# EAGLE schematic LinkIt ONE_v1.0 (EAGLE 6.4)
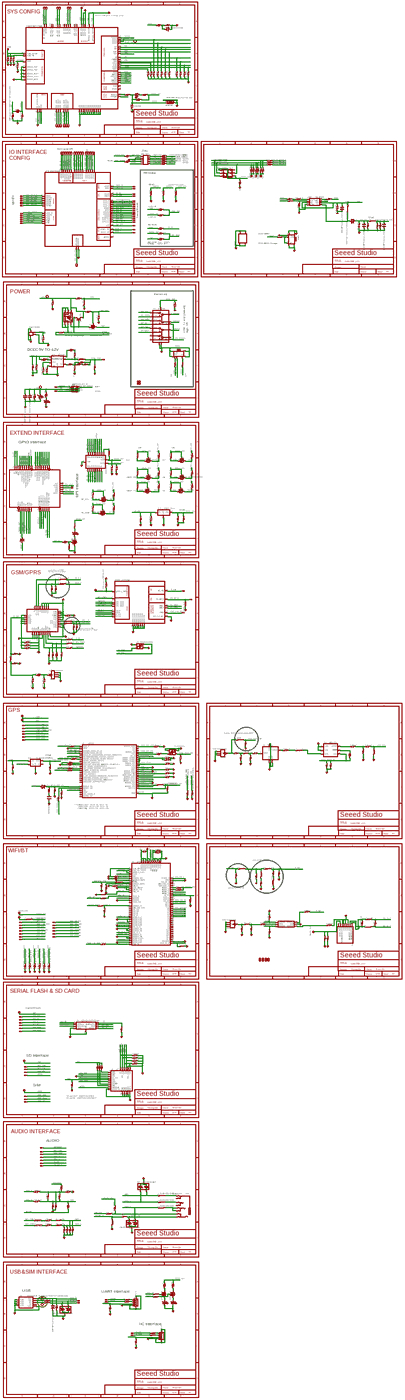
[diagram p0: schematic, sheet 1, overview]
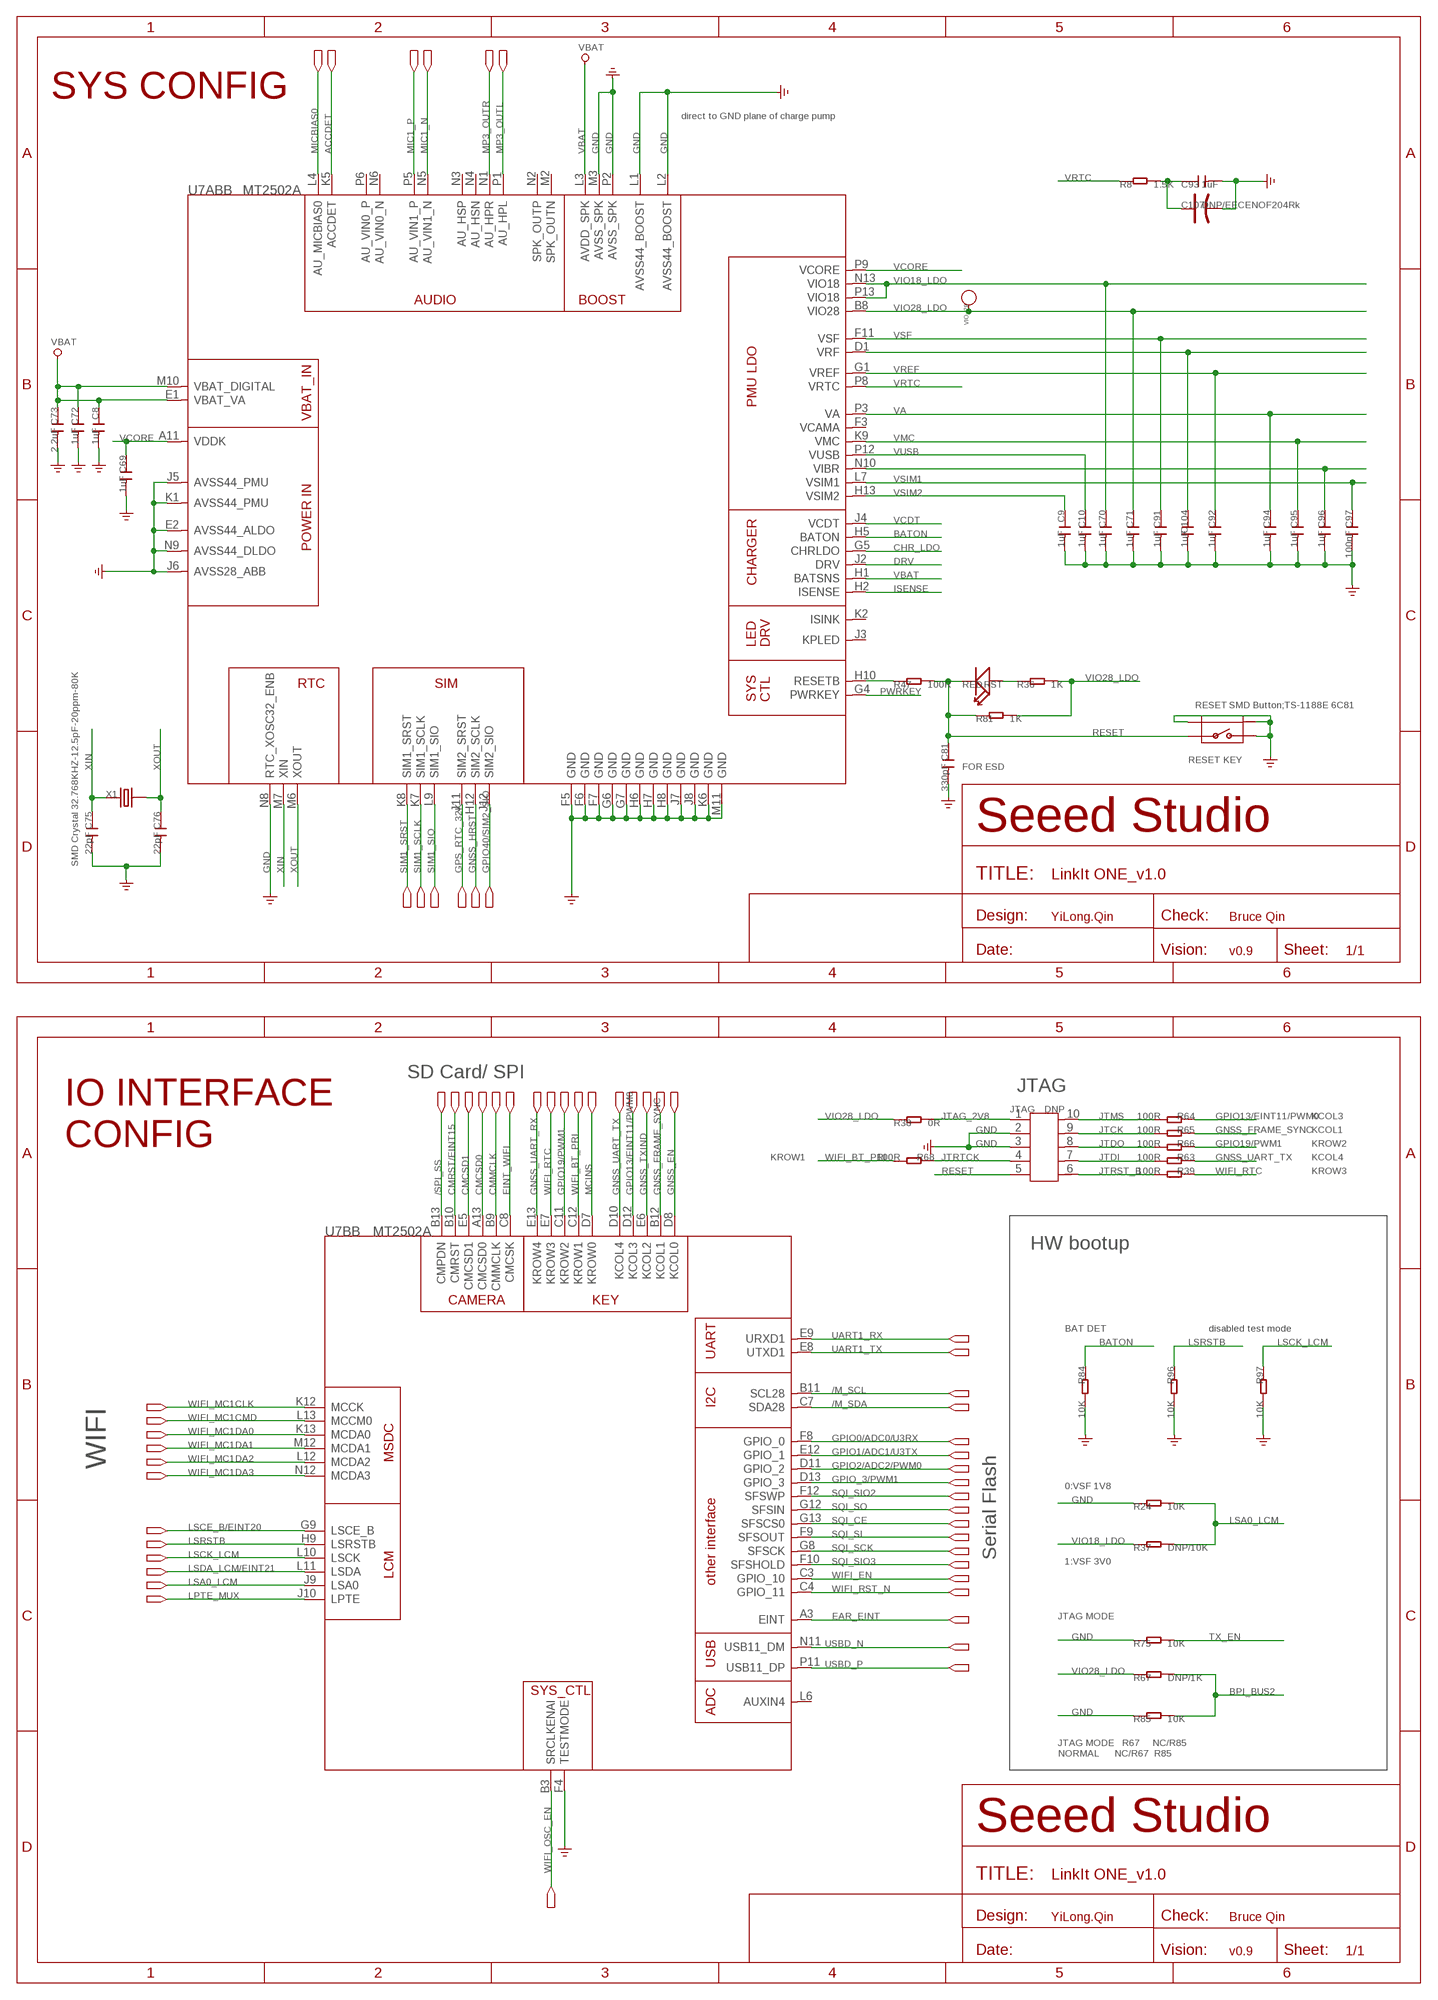
[diagram p1: schematic, sheet 1, part 1 of 8]
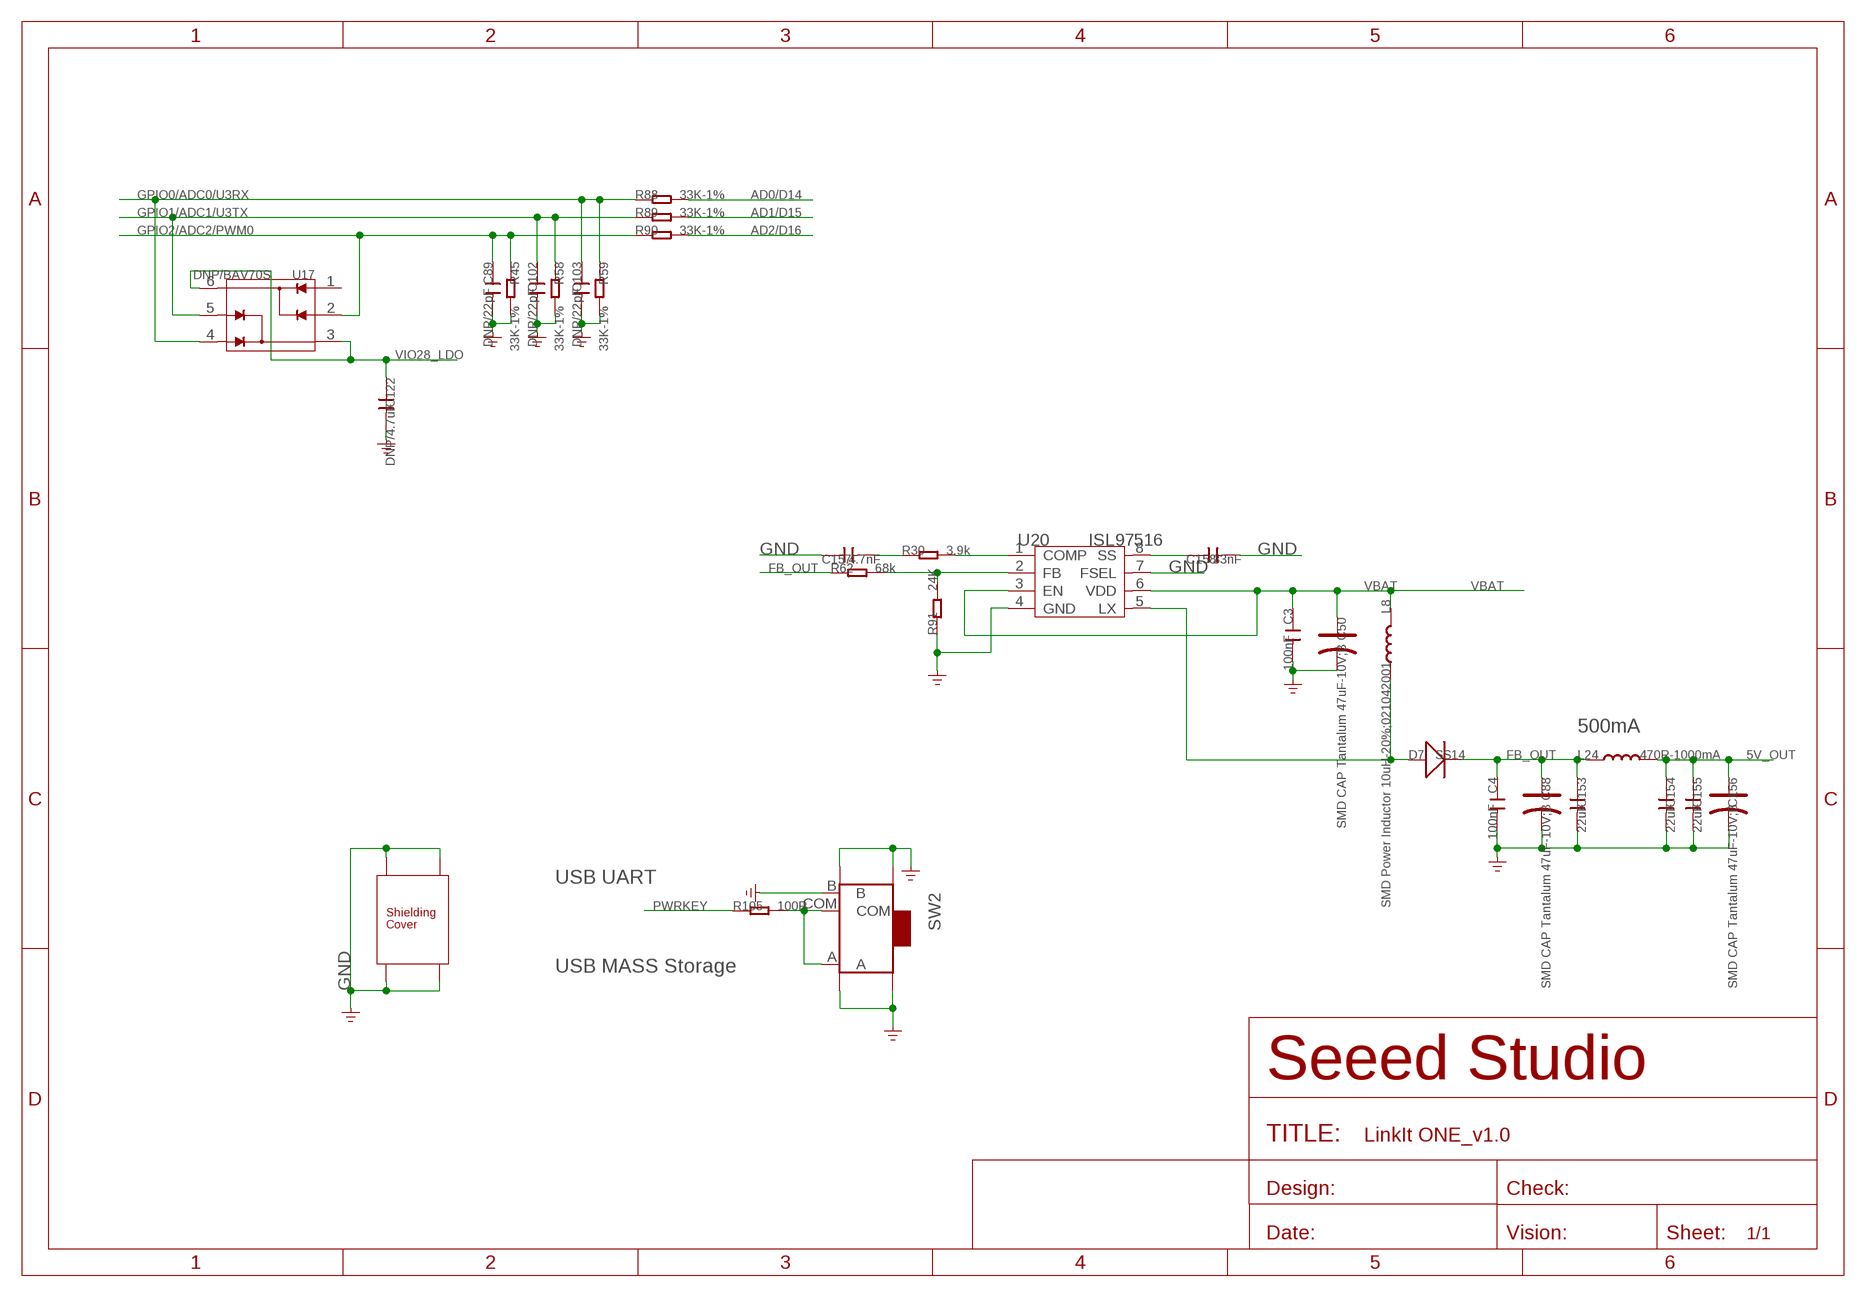
[diagram p2: schematic, sheet 1, part 2 of 8]
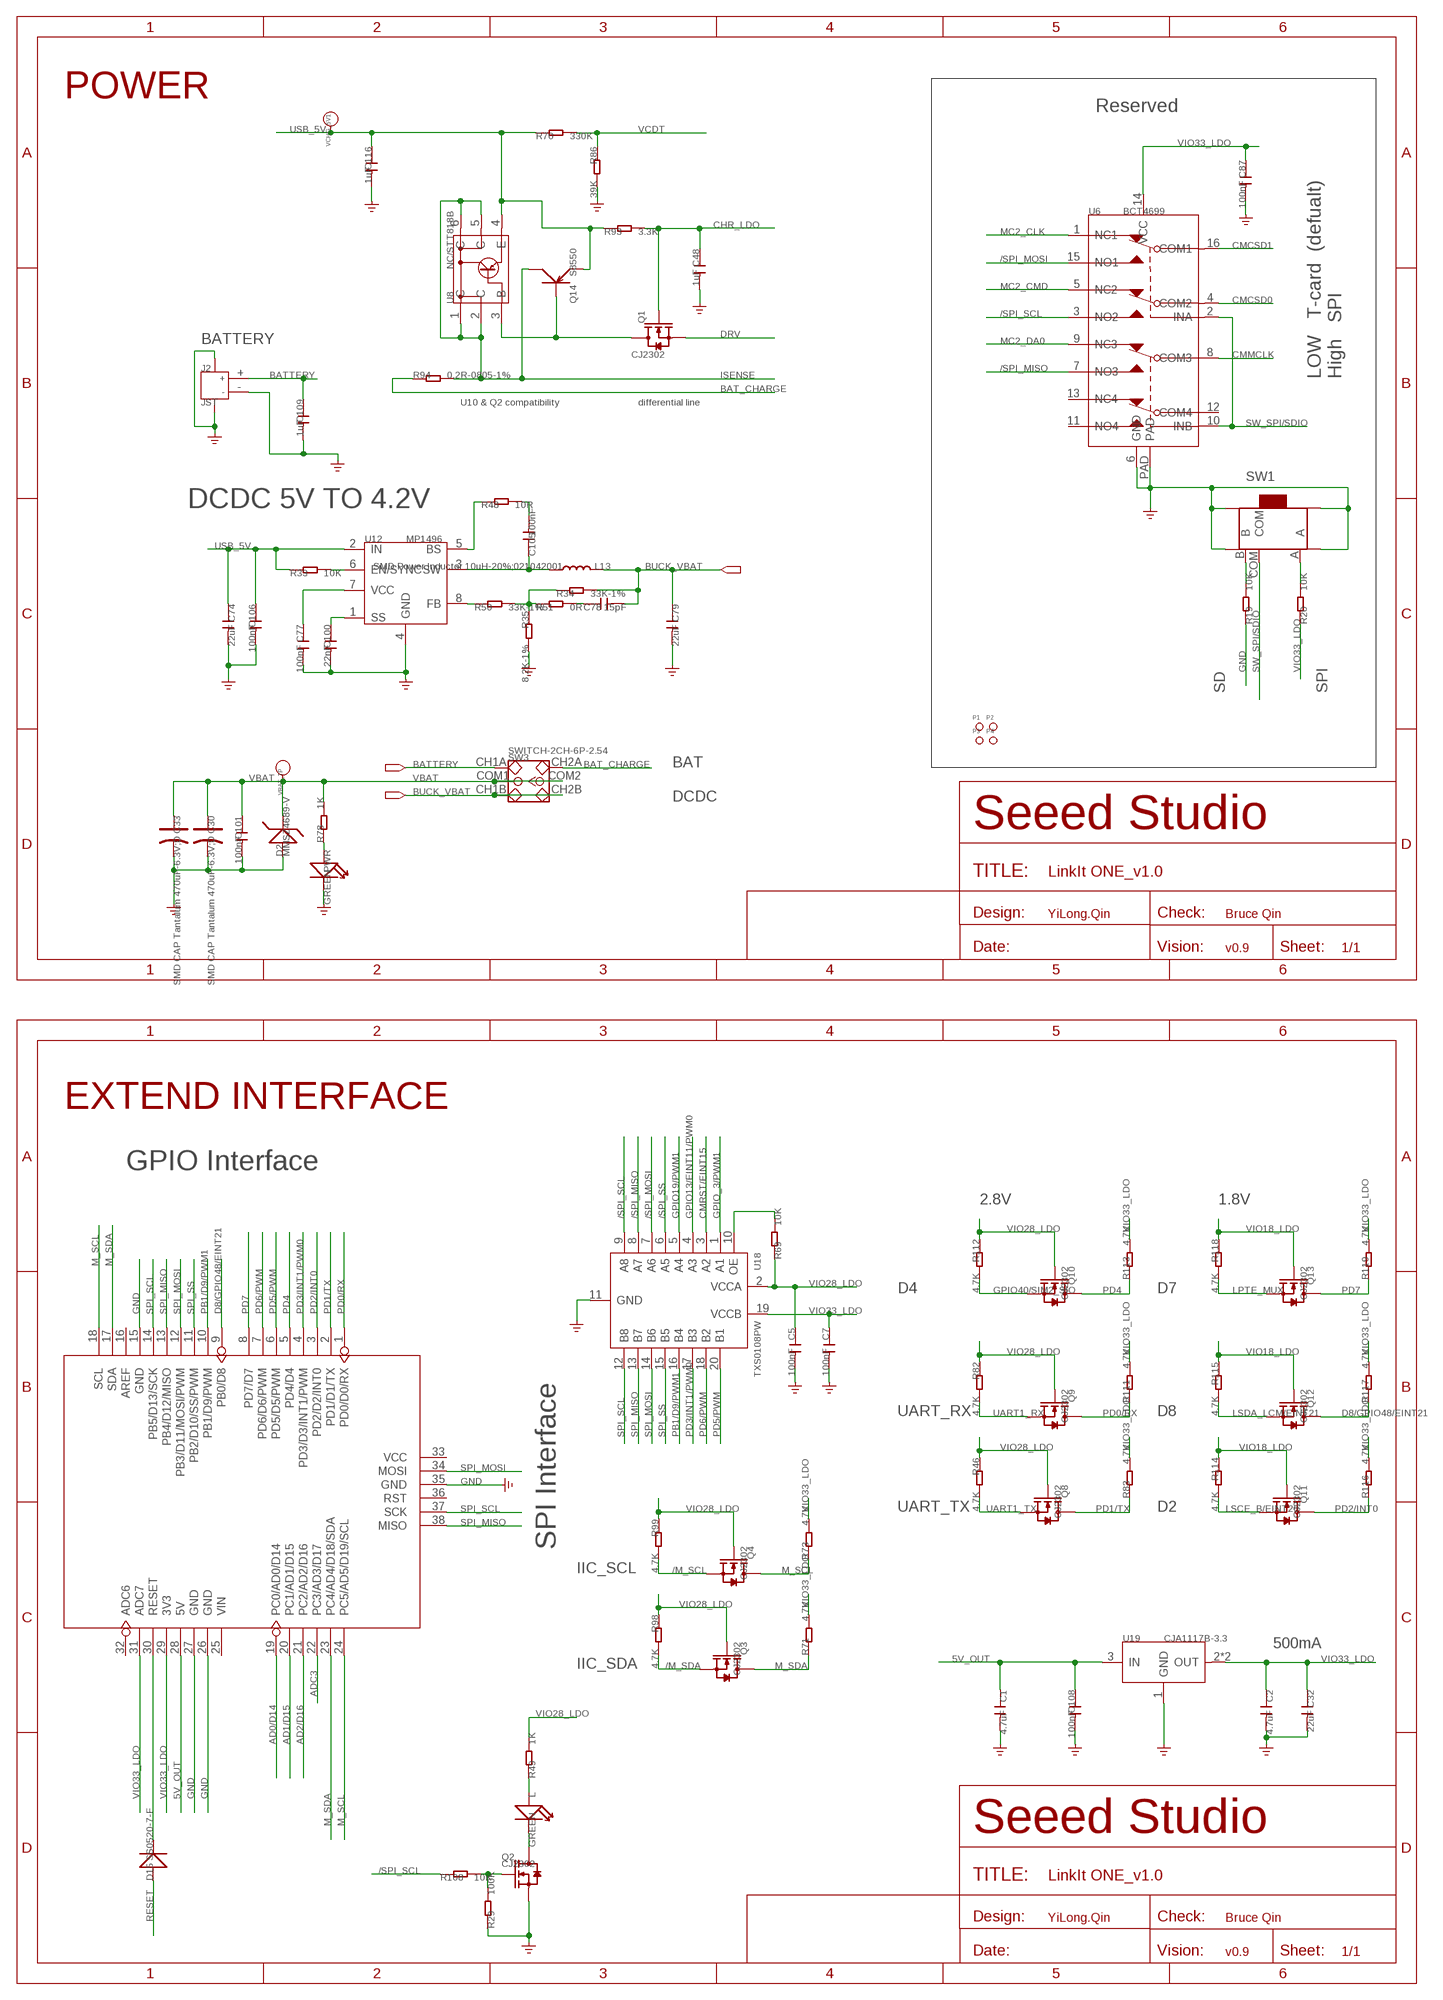
[diagram p3: schematic, sheet 1, part 3 of 8]
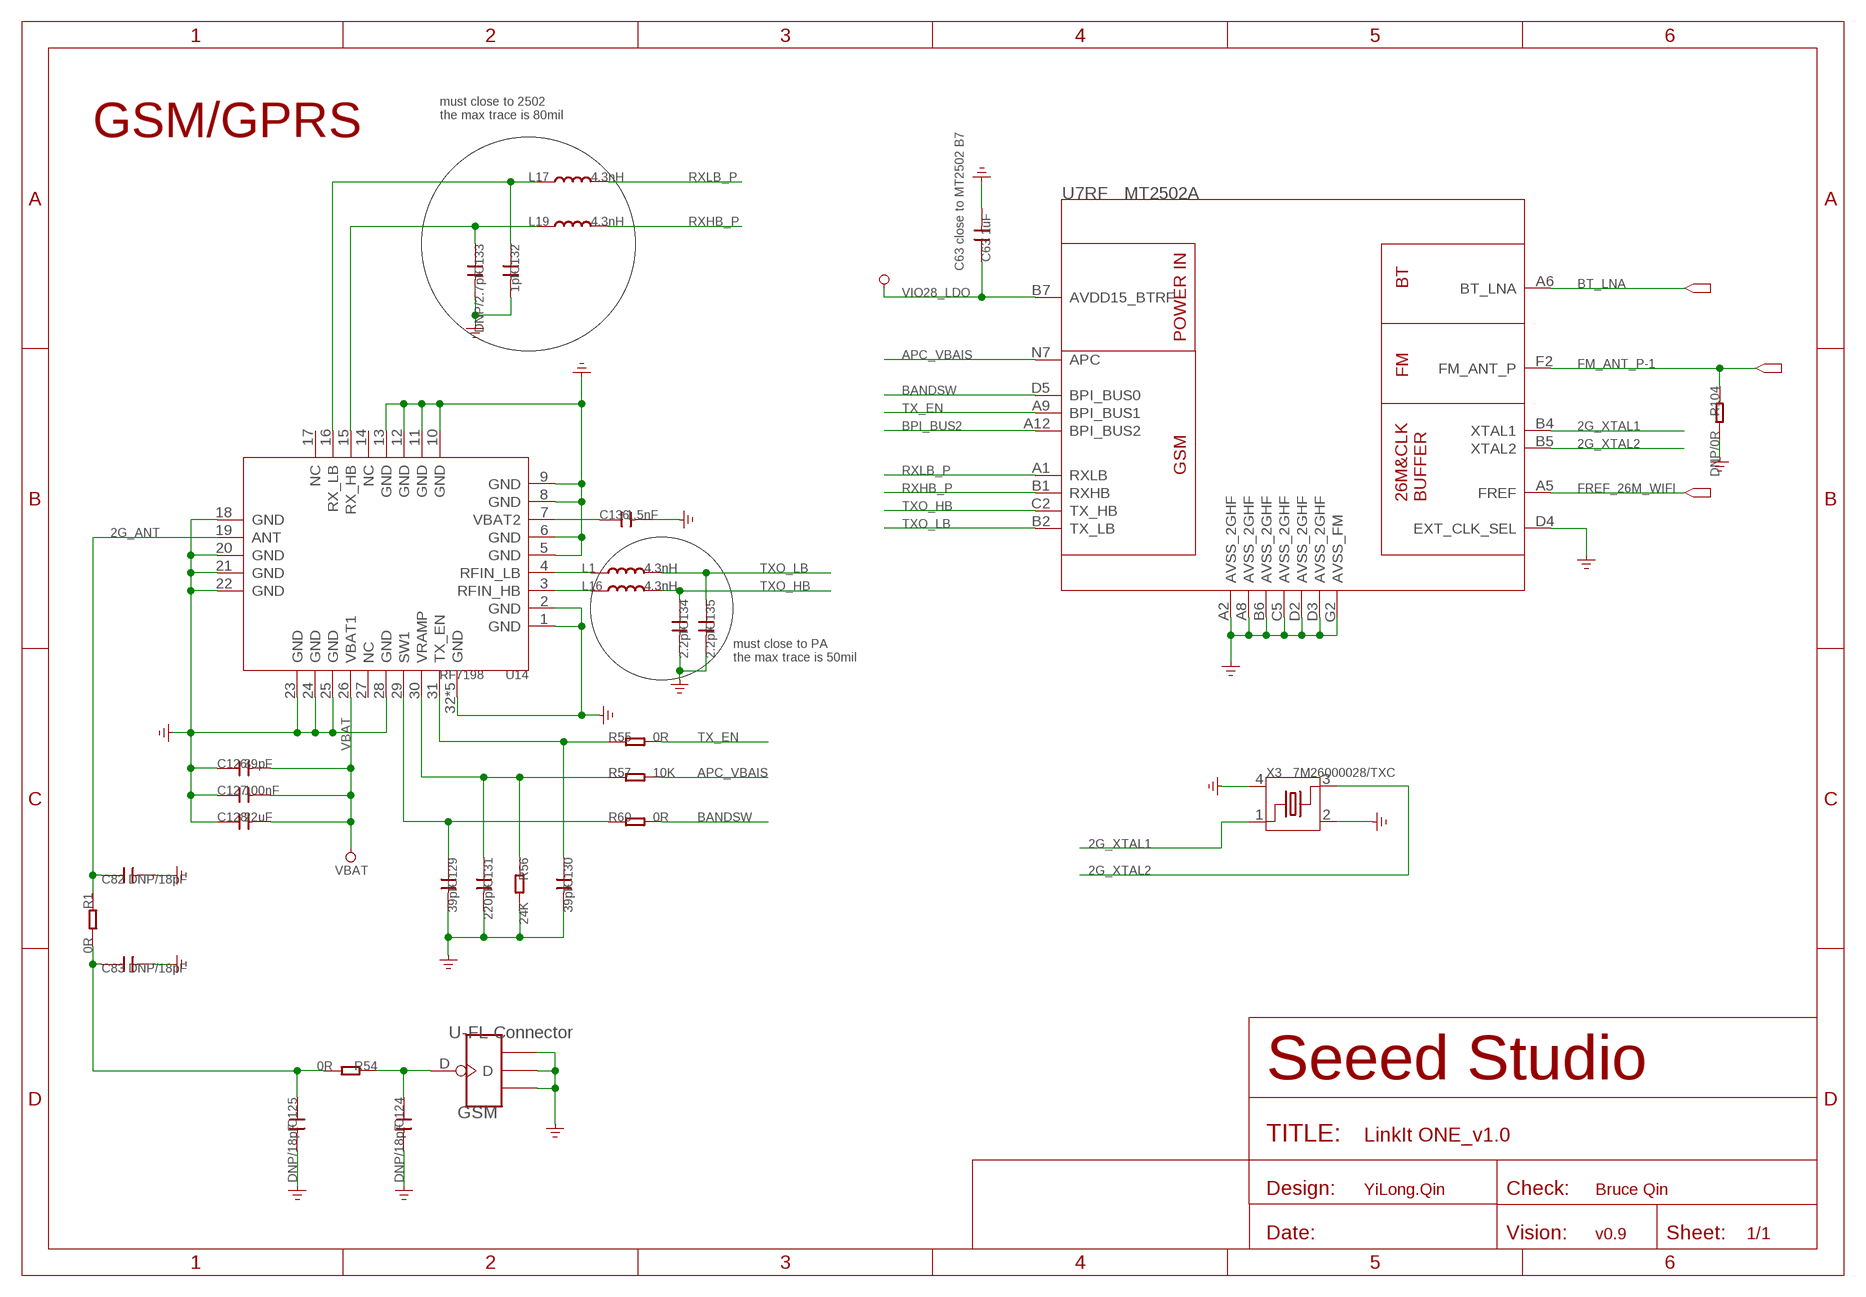
[diagram p4: schematic, sheet 1, part 4 of 8]
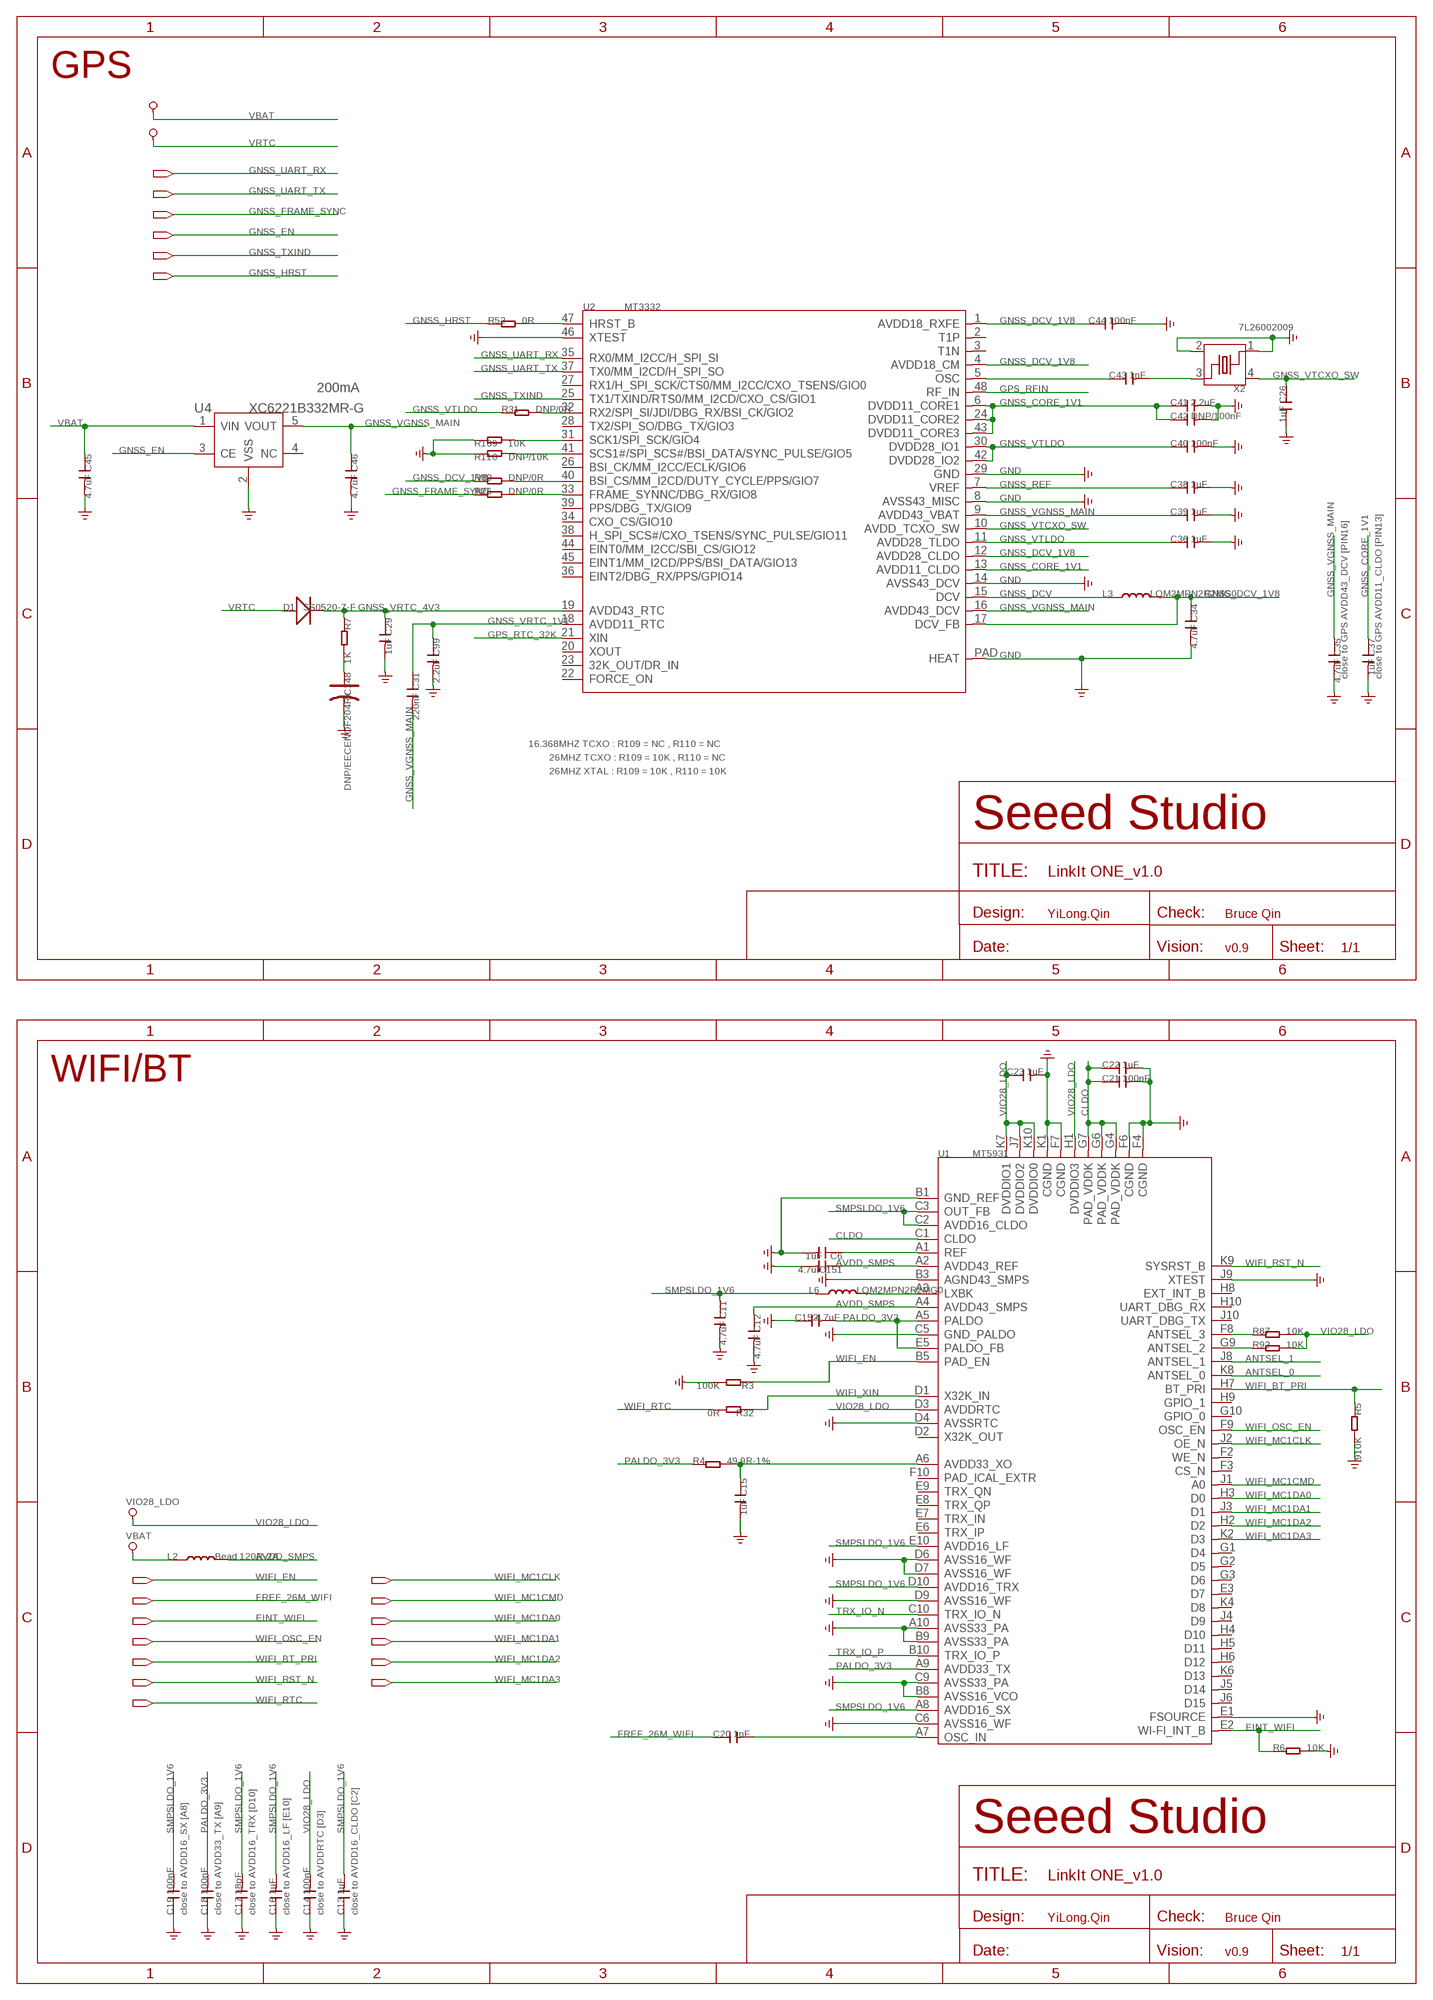
[diagram p5: schematic, sheet 1, part 5 of 8]
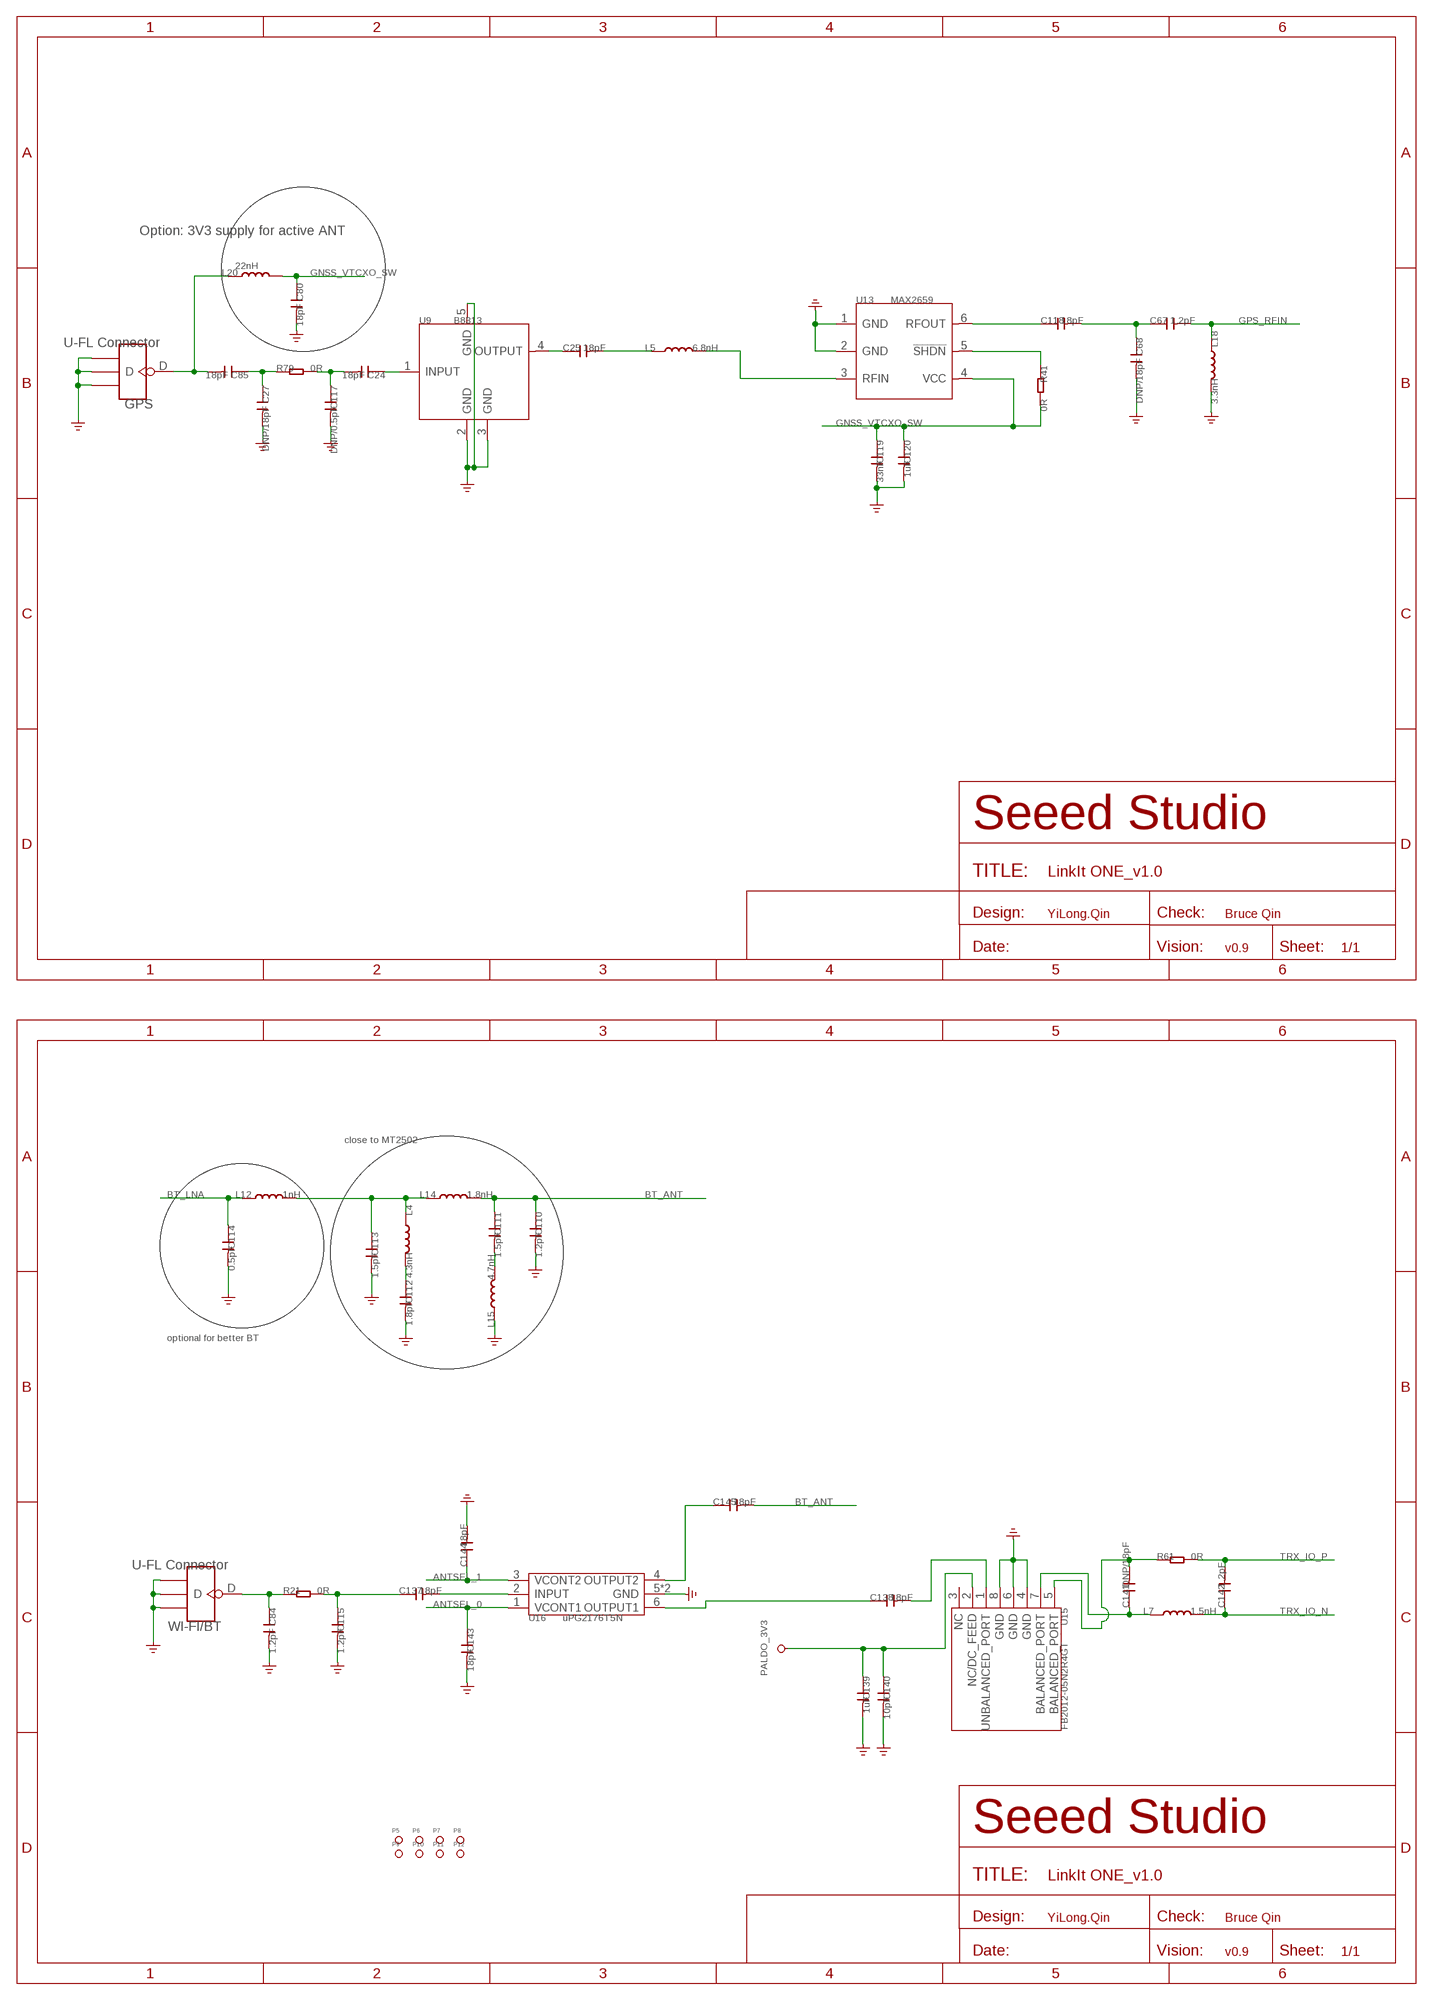
[diagram p6: schematic, sheet 1, part 6 of 8]
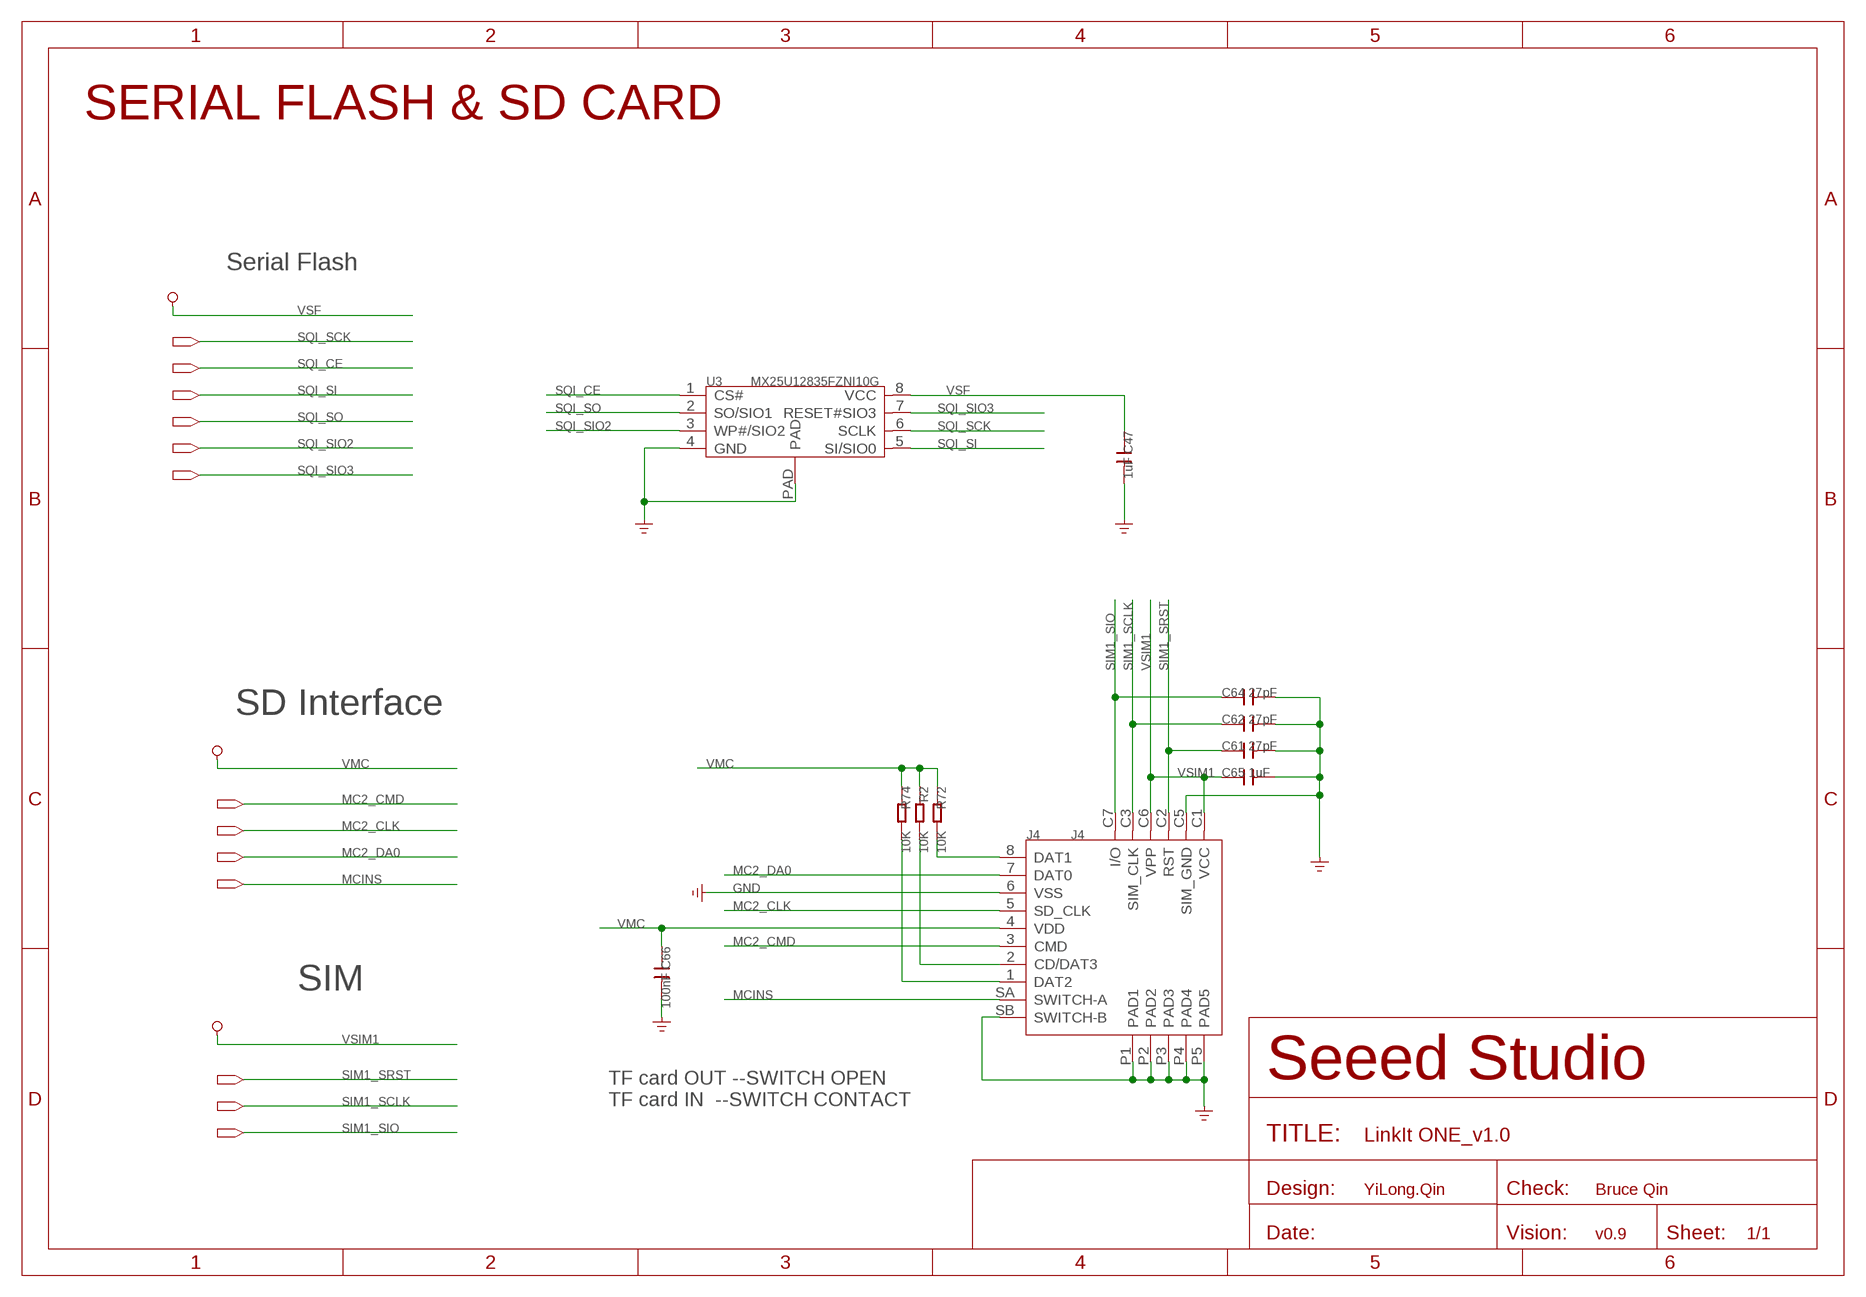
[diagram p7: schematic, sheet 1, part 7 of 8]
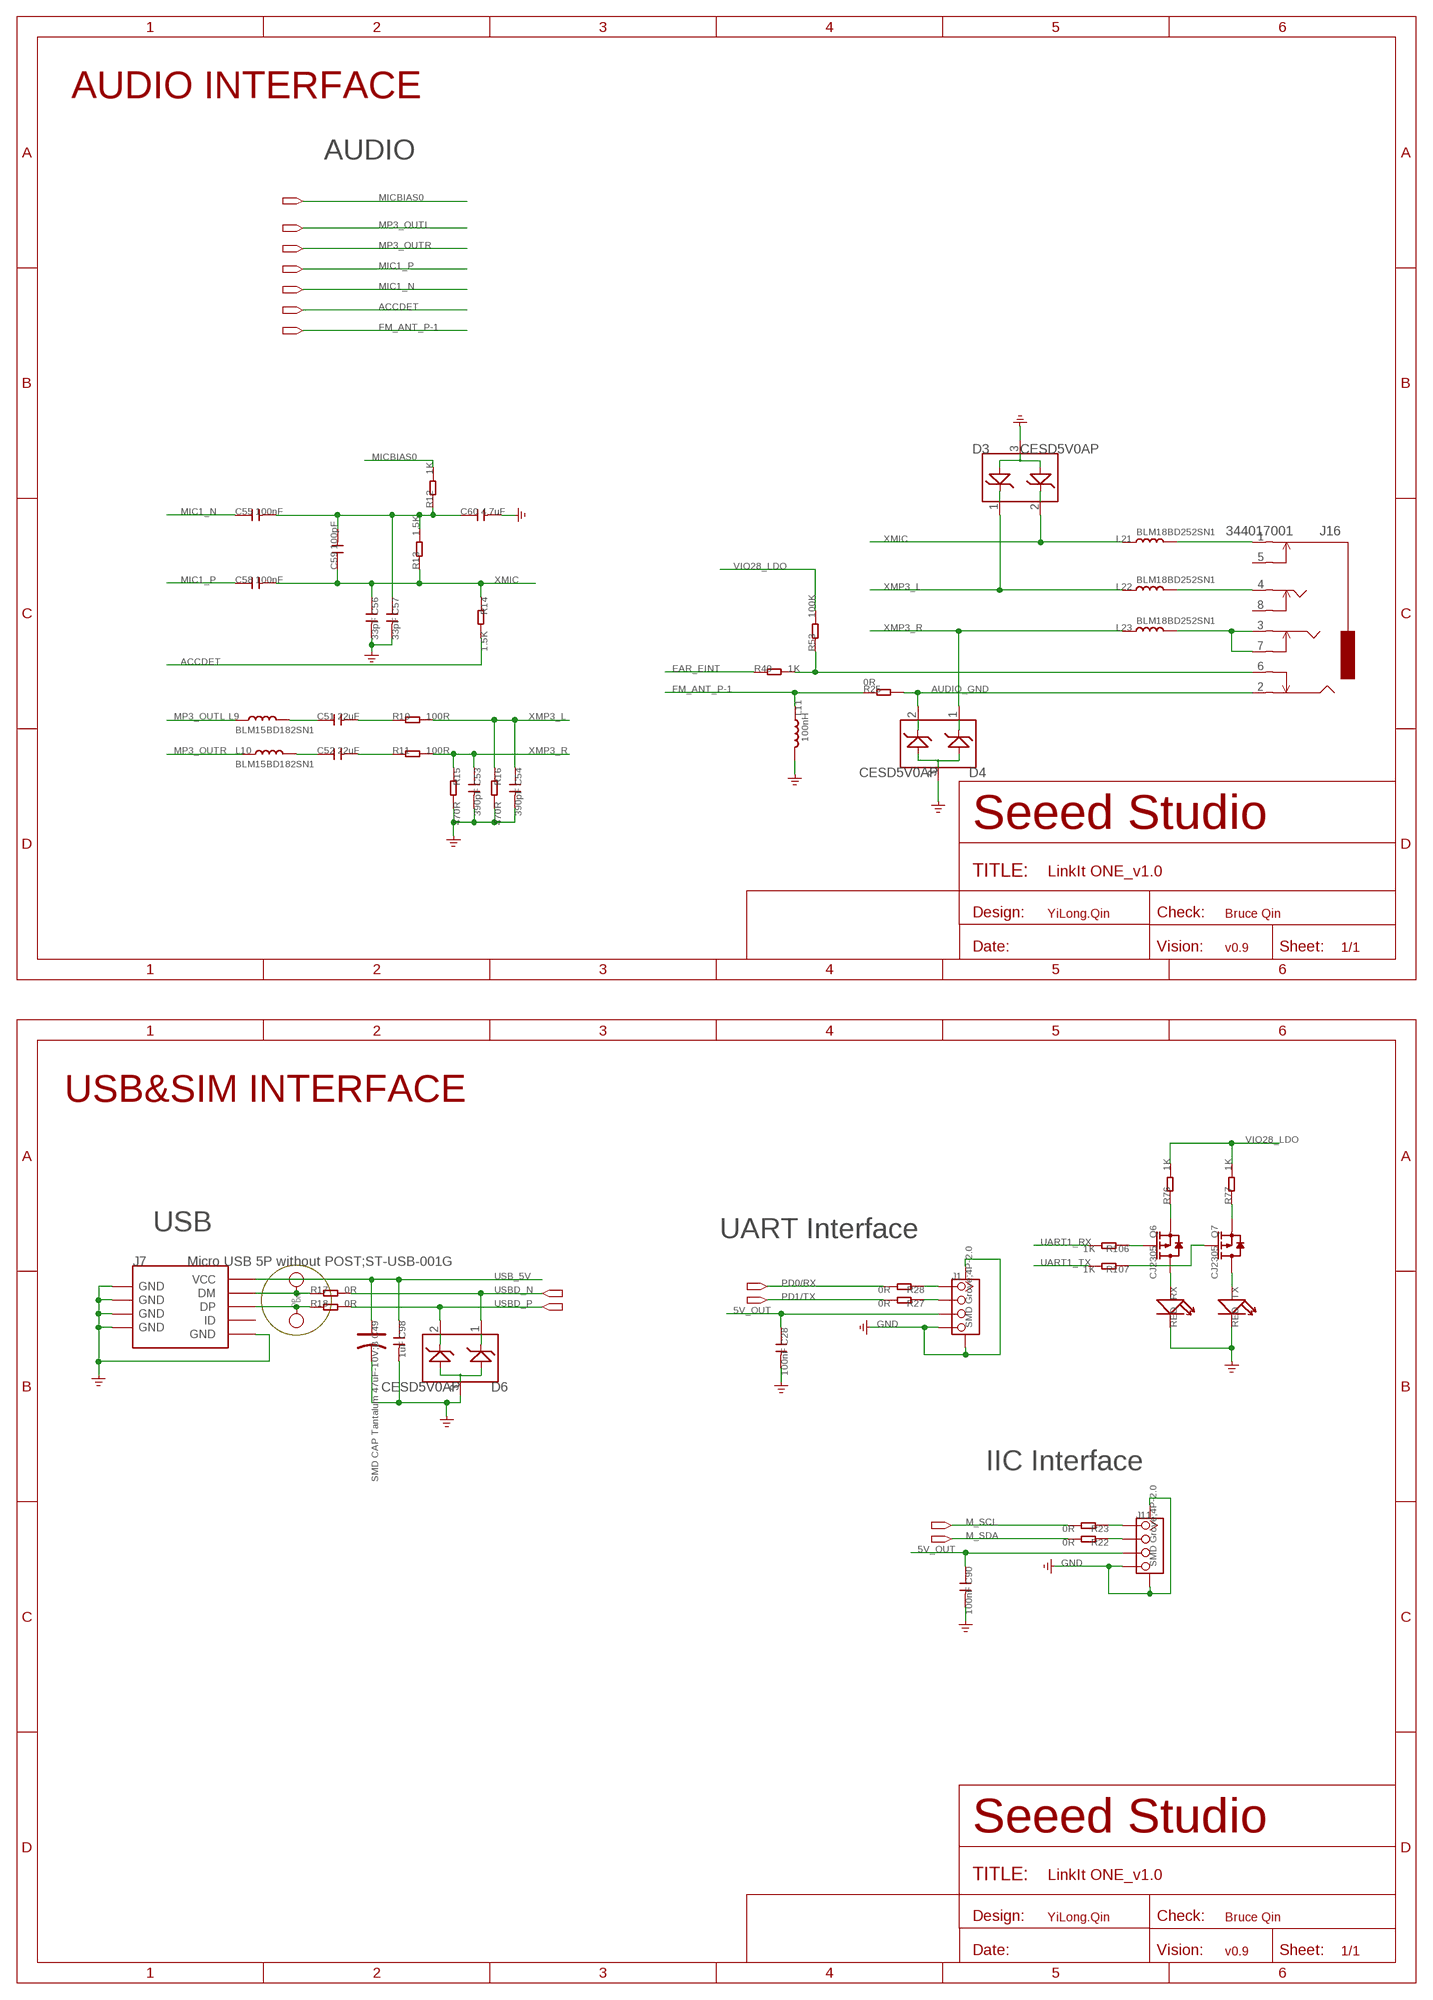
[diagram p8: schematic, sheet 1, part 8 of 8]

## Parts
C1  4.7uF  C-0805  [C0805]
C2  4.7uF  C-0805  [C0805]
C3  100nF  C-0402  [C0402]
C4  100nF  C-0402  [C0402]
C5  100nF  C-0402  [C0402]
C6  1uF  C-0402  [C0402]
C7  100nF  C-0402  [C0402]
C8  1uF  C-0402  [C0402]
C9  1uF  C-0402  [C0402]
C10  1uF  C-0402  [C0402]
C11  4.7uF  C-0805  [C0805]
C12  4.7uF  C-0805  [C0805]
C13  1uF  C-0402  [C0402]
C14  100nF  C-0402  [C0402]
C15  1uF  C-0402  [C0402]
C16  1uF  C-0402  [C0402]
C17  18pF  C-0402  [C0402]
C18  100nF  C-0402  [C0402]
C19  100nF  C-0402  [C0402]
C20  1nF  C-0402  [C0402]
C21  100nF  C-0402  [C0402]
C22  1uF  C-0402  [C0402]
C23  1uF  C-0402  [C0402]
C24  18pF  C-0402  [C0402]
C25  18pF  C-0402  [C0402]
C26  1uF  C-0402  [C0402]
C27  DNP/18pF  C-0402  [C0402]
C28  100nF  C-0402  [C0402]
C29  1uF  C-0402  [C0402]
C30  SMD CAP Tantalum 470uF-6.3V;D  CAP-AVX-D  [AVX-D]
C31  220nF  C-0402  [C0402]
C32  22uF  C-0805  [C0805]
C33  SMD CAP Tantalum 470uF-6.3V;D  CAP-AVX-D  [AVX-D]
C34  4.7uF  C-0805  [C0805]
C35  4.7uF  C-0805  [C0805]
C36  1uF  C-0402  [C0402]
C37  1uF  C-0402  [C0402]
C38  1uF  C-0402  [C0402]
C39  1uF  C-0402  [C0402]
C40  100nF  C-0402  [C0402]
C41  2.2uF  C-0603  [C0603]
C42  DNP/100nF  C-0402  [C0402]
C43  1nF  C-0402  [C0402]
C44  100nF  C-0402  [C0402]
C45  4.7uF  C-0805  [C0805]
C46  4.7uF  C-0805  [C0805]
C47  1uF  C-0402  [C0402]
C48  1uF  C-0402  [C0402]
C49  SMD CAP Tantalum 47uF-10V;B  CAP-AVX-B  [AVX-B]
C50  SMD CAP Tantalum 47uF-10V;B  CAP-AVX-B  [AVX-B]
C51  22uF  C-0805  [C0805]
C52  22uF  C-0805  [C0805]
C53  390pF  C-0402  [C0402]
C54  390pF  C-0402  [C0402]
C55  100nF  C-0402  [C0402]
C56  33pF  C-0402  [C0402]
C57  33pF  C-0402  [C0402]
C58  100nF  C-0402  [C0402]
C59  100pF  C-0402  [C0402]
C60  4.7uF  C-0805  [C0805]
C61  27pF  C-0402  [C0402]
C62  27pF  C-0402  [C0402]
C63  1uF  C-0402  [C0402]
C64  27pF  C-0402  [C0402]
C65  1uF  C-0402  [C0402]
C66  100nF  C-0402  [C0402]
C67  1.2pF  C-0402  [C0402]
C68  DNP/18pF  C-0402  [C0402]
C69  1uF  C-0402  [C0402]
C70  1uF  C-0402  [C0402]
C71  1uF  C-0402  [C0402]
C72  1uF  C-0402  [C0402]
C73  2.2uF  C-0603  [C0603]
C74  22uF  C-0805  [C0805]
C75  22pF  C-0402  [C0402]
C76  22pF  C-0402  [C0402]
C77  100nF  C-0402  [C0402]
C78  15pF  C-0402  [C0402]
C79  22uF  C-0805  [C0805]
C80  18pF  C-0402  [C0402]
C81  330pF  C-0402  [C0402]
C82  DNP/18pF  C-0402  [C0402]
C83  DNP/18pF  C-0402  [C0402]
C84  1.2pF  C-0402  [C0402]
C85  18pF  C-0402  [C0402]
C87  100nF  C-0402  [C0402]
C88  SMD CAP Tantalum 47uF-10V;B  CAP-AVX-B  [AVX-B]
C89  DNP/22pF  C-0402  [C0402]
C90  100nF  C-0402  [C0402]
C91  1uF  C-0402  [C0402]
C92  1uF  C-0402  [C0402]
C93  1uF  C-0402  [C0402]
C94  1uF  C-0402  [C0402]
C95  1uF  C-0402  [C0402]
C96  1uF  C-0402  [C0402]
C97  100nF  C-0402  [C0402]
C98  1uF  C-0402  [C0402]
C99  2.2uF  C-0603  [C0603]
C100  22nF  C-0402  [C0402]
C101  100nF  C-0402  [C0402]
C102  DNP/22pF  C-0402  [C0402]
C103  DNP/22pF  C-0402  [C0402]
C104  1uF  C-0402  [C0402]
C105  100nF  C-0402  [C0402]
C106  100nF  C-0402  [C0402]
C107  DNP/EECENOF204Rk  C-ELECTRIC-DOUBLE-LAYER-CAPACITOR  [2P-D6.8MMX1.8MMH]
C108  100nF  C-0402  [C0402]
C109  1uF  C-0402  [C0402]
C110  1.2pF  C-0402  [C0402]
C111  1.5pF  C-0402  [C0402]
C112  1.8pF  C-0402  [C0402]
C113  1.5pF  C-0402  [C0402]
C114  0.5pF  C-0402  [C0402]
C115  1.2pF  C-0402  [C0402]
C116  1uF  C-0402  [C0402]
C117  DNP/0.5pF  C-0402  [C0402]
C118  18pF  C-0402  [C0402]
C119  33nF  C-0402  [C0402]
C120  1uF  C-0402  [C0402]
C122  DNP/4.7uF  C-0805  [C0805]
C124  DNP/18pF  C-0402  [C0402]
C125  DNP/18pF  C-0402  [C0402]
C126  39pF  C-0402  [C0402]
C127  100nF  C-0402  [C0402]
C128  22uF  C-0805  [C0805]
C129  39pF  C-0402  [C0402]
C130  39pF  C-0402  [C0402]
C131  220pF  C-0402  [C0402]
C132  1pF  C-0402  [C0402]
C133  DNP/2.7pF  C-0402  [C0402]
C134  2.2pF  C-0402  [C0402]
C135  2.2pF  C-0402  [C0402]
C136  1.5nF  C-0402  [C0402]
C137  18pF  C-0402  [C0402]
C138  18pF  C-0402  [C0402]
C139  1uF  C-0402  [C0402]
C140  10pF  C-0402  [C0402]
C141  DNP/18pF  C-0402  [C0402]
C142  1.2pF  C-0402  [C0402]
C143  18pF  C-0402  [C0402]
C144  18pF  C-0402  [C0402]
C145  18pF  C-0402  [C0402]
C148  DNP/EECENOF204Rk  C-ELECTRIC-DOUBLE-LAYER-CAPACITOR  [2P-D6.8MMX1.8MMH]
C151  4.7uF  C-0805  [C0805]
C152  4.7uF  C-0805  [C0805]
C153  22uF  C-0805  [C0805]
C154  22uF  C-0805  [C0805]
C155  22uF  C-0805  [C0805]
C156  SMD CAP Tantalum 47uF-10V;B  CAP-AVX-B  [AVX-B]
C157  4.7nF  C-0402  [C0402]
C158  33nF  C-0402  [C0402]
D1  SS0520-7-F  D'1206'  [SOD123]
D2  MMSZ4689-V  D-VOL'MMSZ4681'  [SOD123-2.7X1.6]
D3  CESD5V0AP  D-ESD-3P  [SOT23]
D4  CESD5V0AP  D-ESD-3P  [SOT23]
D6  CESD5V0AP  D-ESD-3P  [SOT23]
D7  SS14  D'DO-214AC'  [D2010]
D15  SS0520-7-F  D'1206'  [SOD123]
DN  USB_DP  PAD-TEST-POINT'4545'  [TP_4545]
DP  USB_DN  PAD-TEST-POINT'4545'  [TP_4545]
GPS  U-FL Connector  ANTENNA-U-FL  [4P-U-FL]
GSM  U-FL Connector  ANTENNA-U-FL  [4P-U-FL]
J1  SMD Grove;4P-2.0  TWIG-4P-2.0-SMD-FEMALE-REINFORCE'DD'  [4P-SMD-2.0]
J2  JST  JACK-JST-2P-SMD-PW'2.0'  [JST-SMD-2.0-90D]
J4  TF+SIM-VSHO-21-3301  HOLDER-SD/SIM-CONNECTER'VSHO-21-3301'  [16P-L17.4MM*W16.5MM*H2.7MM]
J7  Micro USB 5P without POST;ST-USB-001G  USB-MINIUSB-5P-MICRO  [MICRO-USB]
J11  SMD Grove;4P-2.0  TWIG-4P-2.0-SMD-FEMALE-REINFORCE'DD'  [4P-SMD-2.0]
J16  344017001  AUDIO-8P-SMD'PJ-3536-L6S'  [8P-3.5-SMD]
JTAG  DNP  HEADER-2X5P-2.0  [2*5P-2.0-TESTPOINT]
L  GREEN  LED'0603'  [LED-0603]
L1  4.3nH  L'0402'  [L0402]
L2  Bead 120R-2A  L'0603'  [L0603]
L3  LQM2MPN2R2MG0  L'0806'  [0806]
L4  4.3nH  L'0402'  [L0402]
L5  6.8nH  L'0402'  [L0402]
L6  LQM2MPN2R2MG0  L'0806'  [0806]
L7  1.5nH  L'0402'  [L0402]
L8  SMD Power Inductor 10uH-20%;021042001  L'0630'  [L0630]
L9  BLM15BD182SN1  L'0402'  [L0402]
L10  BLM15BD182SN1  L'0402'  [L0402]
L11  100nH  L'0603'  [L0603]
L12  1nH  L'0402'  [L0402]
L13  SMD Power Inductor 10uH-20%;021042001  L'0630'  [L0630]
L14  1.8nH  L'0402'  [L0402]
L15  4.7nH  L'0402'  [L0402]
L16  4.3nH  L'0402'  [L0402]
L17  4.3nH  L'0402'  [L0402]
L18  3.3nH  L'0402'  [L0402]
L19  4.3nH  L'0402'  [L0402]
L20  22nH  L'0603'  [L0603]
L21  BLM18BD252SN1  L'0603'  [L0603]
L22  BLM18BD252SN1  L'0603'  [L0603]
L23  BLM18BD252SN1  L'0603'  [L0603]
L24  470R-1000mA  L'0805'  [L0805]
P1  PAD-MARK'ANNULAR'  [ROUND-MARK-1.0]
P2  PAD-MARK'ANNULAR'  [ROUND-MARK-1.0]
P3  PAD-MARK'ANNULAR'  [ROUND-MARK-1.0]
P4  PAD-MARK'ANNULAR'  [ROUND-MARK-1.0]
P5  PAD-MARK'ANNULAR'  [ROUND-MARK-1.0]
P6  PAD-MARK'ANNULAR'  [ROUND-MARK-1.0]
P7  PAD-MARK'ANNULAR'  [ROUND-MARK-1.0]
P8  PAD-MARK'ANNULAR'  [ROUND-MARK-1.0]
P9  PAD-MARK'ANNULAR'  [ROUND-MARK-1.0]
P10  PAD-MARK'ANNULAR'  [ROUND-MARK-1.0]
P11  PAD-MARK'ANNULAR'  [ROUND-MARK-1.0]
P12  PAD-MARK'ANNULAR'  [ROUND-MARK-1.0]
PWR  GREEN  LED'0603'  [LED-0603]
Q1  CJ2302  MOSFET-N'SOT23'  [SOT23]
Q2  CJ2302  MOSFET-N'SOT23'  [SOT23]
Q3  CJ2302  MOSFET-N'SOT23'  [SOT23]
Q4  CJ2302  MOSFET-N'SOT23'  [SOT23]
Q6  CJ2305  MOSFET-P'SI2323CDS/SI2305DS<BR>'  [SOT23]
Q7  CJ2305  MOSFET-P'SI2323CDS/SI2305DS<BR>'  [SOT23]
Q8  CJ2302  MOSFET-N'SOT23'  [SOT23]
Q9  CJ2302  MOSFET-N'SOT23'  [SOT23]
Q10  CJ2302  MOSFET-N'SOT23'  [SOT23]
Q11  CJ2302  MOSFET-N'SOT23'  [SOT23]
Q12  CJ2302  MOSFET-N'SOT23'  [SOT23]
Q13  CJ2302  MOSFET-N'SOT23'  [SOT23]
Q14  S8550  TRANSISTOR-PNP-SOT23  [SOT23]
R1  0R  R-0402  [R0402]
R2  10K  R-0402  [R0402]
R3  100K  R-0402  [R0402]
R4  49.9R-1%  R-0402  [R0402]
R5  910K  R-0402  [R0402]
R6  10K  R-0402  [R0402]
R7  1K  R-0402  [R0402]
R8  1.5K  R-0402  [R0402]
R10  100R  R-0402  [R0402]
R11  100R  R-0402  [R0402]
R12  1K  R-0402  [R0402]
R13  1.5K  R-0402  [R0402]
R14  1.5K  R-0402  [R0402]
R15  470R  R-0402  [R0402]
R16  470R  R-0402  [R0402]
R17  0R  R-0402  [R0402]
R18  0R  R-0402  [R0402]
R19  10K  R-0402  [R0402]
R20  10K  R-0402  [R0402]
R21  0R  R-0402  [R0402]
R22  0R  R-0402  [R0402]
R23  0R  R-0402  [R0402]
R24  10K  R-0402  [R0402]
R25  0R  R-0402  [R0402]
R26  DNP/0R  R-0402  [R0402]
R27  0R  R-0402  [R0402]
R28  0R  R-0402  [R0402]
R29  100K  R-0402  [R0402]
R30  3.9k  R-0402  [R0402]
R31  DNP/0R  R-0402  [R0402]
R32  0R  R-0402  [R0402]
R33  10K  R-0402  [R0402]
R34  33K-1%  R-0402  [R0402]
R35  8.2K-1%  R-0402  [R0402]
R36  1K  R-0402  [R0402]
R37  DNP/10K  R-0402  [R0402]
R38  0R  R-0402  [R0402]
R39  100R  R-0402  [R0402]
R40  1K  R-0402  [R0402]
R41  0R  R-0402  [R0402]
R45  33K-1%  R-0402  [R0402]
R46  4.7K  R-0402  [R0402]
R47  100R  R-0402  [R0402]
R48  10R  R-0402  [R0402]
R49  1K  R-0402  [R0402]
R50  33K-1%  R-0402  [R0402]
R51  0R  R-0402  [R0402]
R52  0R  R-0402  [R0402]
R53  100K  R-0402  [R0402]
R54  0R  R-0402  [R0402]
R55  0R  R-0402  [R0402]
R56  24K  R-0402  [R0402]
R57  10K  R-0402  [R0402]
R58  33K-1%  R-0402  [R0402]
R59  33K-1%  R-0402  [R0402]
R60  0R  R-0402  [R0402]
R61  0R  R-0402  [R0402]
R62  68k  R-0402  [R0402]
R63  100R  R-0402  [R0402]
R64  100R  R-0402  [R0402]
R65  100R  R-0402  [R0402]
R66  100R  R-0402  [R0402]
R67  DNP/1K  R-0402  [R0402]
R68  100R  R-0402  [R0402]
R69  10K  R-0402  [R0402]
R70  330K  R-0402  [R0402]
R71  4.7K  R-0402  [R0402]
R72  10K  R-0402  [R0402]
R73  4.7K  R-0402  [R0402]
R74  10K  R-0402  [R0402]
R75  10K  R-0402  [R0402]
R76  1K  R-0402  [R0402]
R77  1K  R-0402  [R0402]
R78  1K  R-0402  [R0402]
R79  0R  R-0402  [R0402]
R80  DNP/0R  R-0402  [R0402]
R81  1K  R-0402  [R0402]
R82  4.7K  R-0402  [R0402]
R83  4.7K  R-0402  [R0402]
R84  10K  R-0402  [R0402]
R85  10K  R-0402  [R0402]
R86  39K  R-0402  [R0402]
R87  10K  R-0402  [R0402]
R88  33K-1%  R-0402  [R0402]
R89  33K-1%  R-0402  [R0402]
R90  33K-1%  R-0402  [R0402]
R91  24K  R-0402  [R0402]
R92  10K  R-0402  [R0402]
R93  3.3K  R-0402  [R0402]
R94  0.2R-0805-1%  R-0805  [R0805]
R96  10K  R-0402  [R0402]
R97  10K  R-0402  [R0402]
R98  4.7K  R-0402  [R0402]
R99  4.7K  R-0402  [R0402]
R104  DNP/0R  R-0402  [R0402]
R105  100R  R-0402  [R0402]
R106  1K  R-0402  [R0402]
R107  1K  R-0402  [R0402]
R108  10K  R-0402  [R0402]
R109  10K  R-0402  [R0402]
R110  DNP/10K  R-0402  [R0402]
R111  4.7K  R-0402  [R0402]
R112  4.7K  R-0402  [R0402]
R113  4.7K  R-0402  [R0402]
R114  4.7K  R-0402  [R0402]
R115  4.7K  R-0402  [R0402]
R116  4.7K  R-0402  [R0402]
R117  4.7K  R-0402  [R0402]
R118  4.7K  R-0402  [R0402]
R119  4.7K  R-0402  [R0402]
RESET  SMD Button;TS-1188E 6C81  BUTTON-4P-REINFORCE'TS-1188E'  [4P-SMD-7X3.5X3.5H]
RST  RED  LED'0603'  [LED-0603]
RX  RED  LED'0603'  [LED-0603]
SW1  SWITCH-3P-SMD-6.6X2.8  [3P-SMD-2CH-6.6X2.8-REINFORCE]
SW2  SWITCH-3P-SMD-6.6X2.8  [3P-SMD-2CH-6.6X2.8-REINFORCE]
SW3  SWITCH-2CH-6P-2.54  SWITCH-2CH-6P  [6P-2CH-2.54-7.6X3.0]
TX  RED  LED'0603'  [LED-0603]
U1  MT5931  [TFBGA84]
U2  MT3332  [QFN48-6X6MM]
U3  MX25U12835FZNI10G  MX25U12835F  [WSON8-6X5X0.8H-W/HEAT]
U4  XC6221B332MR-G  XC6228  [SOT-25J]
U6  BCT4699  [TQFN16]
U7  MT2502A  [VFBGA143]
U8  NC/STT818B  STT818B  [SOT23-6L]
U9  B8313  FILTER-FOR_GPS1500  [5P-SMD-1.4X1.1MM]
U10  SHIELDING-COVER  [SHIELD-SMD-44.5X53.5]
U11  PCB  ARDUINO-38P  [ARDUINO-38P]
U12  MP1496  MP1496DJ  [TSOT23-8]
U13  MAX2659  [6P-SMD-1.5X1.0X0.72H]
U14  RF7198  RF1798  [32P-SMD-RF1798-5.3MMX5.25MMX0.73H]
U15  FB2012-05N2R4GT  FILTER-FB2012  [8P-SMD-2X1.25X0.7H]
U16  uPG2176T5N  UPG2176T5N  [TSON6]
U17  DNP/BAV70S  BAV70S  [SOT363]
U18  TXS0108PW  TXS0108E  [TSSOP20]
U19  CJA1117B-3.3  LD1117'SOT89'  [SOT89]
U20  ISL97516  [MSOP8]
VBAT_TP  VBAT  PAD-TEST-POINT'4545'  [TP_4545]
VCHG_5V1  PAD-TEST-POINT'4545'  [TP_4545]
VIO_28  PAD-TEST-POINT'4545'  [TP_4545]
WI-FI/BT  U-FL Connector  ANTENNA-U-FL  [4P-U-FL]
X1  SMD Crystal 32.768KHZ-12.5pF-20ppm-80K  CRYSTAL'NX2012SA'  [2P-SMD-2.05X1.2]
X2  7L26002009  CRYSTAL'NX2520SA'  [2520]
X3  7M26000028/TXC  CRYSTAL'3225'  [4P-SMD-3.2X2.5]

## Nets
2G_ANT: C82.1 R1.1 U14.19(ANT)
2G_XTAL1: U7.B4(RF:XTAL1) X3.1
2G_XTAL2: U7.B5(RF:XTAL2) X3.3
5V_OUT: C1.1 C28.1 C90.1 C108.1 C154.1 C155.1 C156.+ J1.3 J11.3 L24.2 U11.28(5V) U19.3(IN)
/M_SCL: Q4.2(S) R99.2 U7.B11(BB:SCL28)
/M_SDA: Q3.2(S) R98.2 U7.C7(BB:SDA28)
/SPI_MISO: U6.7(NO3) U18.8(A7)
/SPI_MOSI: U6.15(NO1) U18.7(A6)
/SPI_SCL: R108.1 U6.3(NO2) U18.9(A8)
/SPI_SS: U7.B13(BB:CMPDN) U18.6(A5)
ACCDET: R14.2 U7.K5(ABB:ACCDET)
AD0/D14: R88.2 U11.19(PC0/AD0/D14)
AD1/D15: R89.2 U11.20(PC1/AD1/D15)
AD2/D16: R90.2 U11.21(PC2/AD2/D16)
ADC3: U11.22(PC3/AD3/D17)
ANTSEL_0: C143.1 U1.K8(ANTSEL_0) U16.1(VCONT1)
ANTSEL_1: C144.1 U1.J8(ANTSEL_1) U16.3(VCONT2)
APC_VBAIS: R57.2 U7.N7(RF:APC)
AUDIO_GND: D4.2 J16.2 R25.2
AVDD_SMPS: C12.1 C151.1 L2.2 U1.A2(AVDD43_REF) U1.A4(AVDD43_SMPS)
BANDSW: R60.2 U7.D5(RF:BPI_BUS0)
BAT_CHARGE: R94.1 SW3.CH2A
BATON: R84.1 U7.H5(ABB:BATON)
BATTERY: C109.1 J2.+ SW3.CH1A
BPI_BUS2: R67.2 R85.2 U7.A12(RF:BPI_BUS2)
BT_ANT: C110.1 C111.1 C145.2 L14.2
BT_LNA: C114.1 L12.1 U7.A6(RF:BT_LNA)
BUCK_VBAT: C78.2 C79.1 L13.1 R34.2 SW3.CH1B SW3.CH2B
CHR_LDO: C48.1 Q1.1(G) R93.2 U7.G5(ABB:CHRLDO)
CLDO: C21.1 C22.1 U1.C1(CLDO) U1.G4(PAD_VDDK) U1.G6(PAD_VDDK) U1.G7(PAD_VDDK)
CMCSD0: U6.4(COM2) U7.A13(BB:CMCSD0)
CMCSD1: U6.16(COM1) U7.E5(BB:CMCSD1)
CMMCLK: U6.8(COM3) U7.B9(BB:CMMCLK)
CMRST/EINT15: U7.B10(BB:CMRST) U18.3(A2)
D8/GPIO48/EINT21: Q12.3(D) R117.1 U11.9(PB0/D8)
DRV: Q1.2(S) U7.J2(ABB:DRV)
EAR_EINT: R40.1 U7.A3(BB:EINT)
EINT_WIFI: R6.1 U1.E2(WI-FI_INT_B) U7.C8(BB:CMCSK)
FB_OUT: C4.1 C88.+ C153.1 D7.- L24.1 R62.1
FM_ANT_P-1: L11.1 R25.1 R104.1 U7.F2(RF:FM_ANT_P)
FREF_26M_WIFI: C20.1 U7.A5(RF:FREF)
GND: C1.2 C2.2 C3.2 C4.2 C5.2 C6.2 C7.2 C8.2 C9.2 C10.2 C11.2 C12.2 C13.1 C14.1 C15.2 C16.1 C17.1 C18.1 C19.1 C21.2 C22.2 C23.2 C26.2 C27.2 C28.2 C29.2 C30.- C32.2 C33.- C34.2 C35.2 C36.2 C37.2 C38.2 C39.2 C40.2 C41.2 C42.2 C44.2 C45.2 C46.2 C47.2 C48.2 C49.- C50.- C53.2 C54.2 C56.2 C57.2 C60.2 C61.2 C62.2 C63.2 C64.2 C65.2 C66.2 C68.2 C69.2 C70.2 C71.2 C72.2 C73.2 C74.2 C75.2 C76.2 C77.2 C79.2 C80.2 C81.2 C82.2 C83.2 C84.2 C87.2 C88.- C89.2 C90.2 C91.2 C92.2 C93.2 C94.2 C95.2 C96.2 C97.2 C98.2 C99.2 C100.2 C101.2 C102.2 C103.2 C104.2 C106.2 C107.- C108.2 C109.2 C110.2 C112.2 C113.2 C114.2 C115.2 C116.2 C117.2 C119.2 C120.2 C122.2 C124.2 C125.2 C126.1 C127.1 C128.1 C129.2 C130.2 C131.2 C132.2 C133.2 C134.2 C135.2 C136.2 C139.2 C140.2 C143.2 C144.2 C148.- C151.2 C152.1 C153.2 C154.2 C155.2 C156.- C157.1 C158.2 D2.1(+) D3.3 D4.3 D6.3 GPS.GND1 GPS.GND2 GPS.GND3 GSM.GND1 GSM.GND2 GSM.GND3 J1.4 J1.SS1 J1.SS2 J2.3 J2.4 J2.- J4.6(VSS) J4.C5(SIM_GND) J4.P1(PAD1) J4.P2(PAD2) J4.P3(PAD3) J4.P4(PAD4) J4.P5(PAD5) J4.SB(SWITCH-B) J7.5(GND) J7.S1(GND) J7.S2(GND) J7.S3(GND) J7.S4(GND) J7.S5(GND) J7.S6(GND) J11.4 J11.SS1 J11.SS2 JTAG.2 JTAG.3 L11.2 L15.1 L18.2 PWR.- Q2.2(S) R3.2 R5.2 R6.2 R15.2 R16.2 R19.1 R24.1 R29.1 R35.2 R45.2 R56.2 R58.2 R59.2 R75.1 R84.2 R85.1 R86.2 R91.1 R96.2 R97.2 R104.2 R109.1 R110.1 RESET.2 RESET.S1 RESET.S2 RX.- SW1.SS1 SW1.SS2 SW1.SS3 SW1.SS4 SW2.B SW2.SS1 SW2.SS2 SW2.SS3 SW2.SS4 TX.- U1.A10(AVSS33_PA) U1.B1(GND_REF) U1.B3(AGND43_SMPS) U1.B8(AVSS16_VCO) U1.B9(AVSS33_PA) U1.C5(GND_PALDO) U1.C6(AVSS16_WF) U1.C9(AVSS33_PA) U1.D4(AVSSRTC) U1.D6(AVSS16_WF) U1.D7(AVSS16_WF) U1.D9(AVSS16_WF) U1.E1(FSOURCE) U1.F4(CGND) U1.F6(CGND) U1.F7(CGND) U1.J9(XTEST) U1.K1(CGND) U2.8(AVSS43_MISC) U2.14(AVSS43_DCV) U2.29(GND) U2.46(XTEST) U2.PAD(HEAT) U3.4(GND) U3.PAD U4.2(VSS) U6.6(GND) U6.PAD U7.A2(RF:AVSS_2GHF) U7.A8(RF:AVSS_2GHF) U7.B6(RF:AVSS_2GHF) U7.C5(RF:AVSS_2GHF) U7.D2(RF:AVSS_2GHF) U7.D3(RF:AVSS_2GHF) U7.D4(RF:EXT_CLK_SEL) U7.E2(ABB:AVSS44_ALDO) U7.F4(BB:TESTMODE) U7.F5(ABB:GND) U7.F6(ABB:GND) U7.F7(ABB:GND) U7.G2(RF:AVSS_FM) U7.G6(ABB:GND) U7.G7(ABB:GND) U7.H6(ABB:GND) U7.H7(ABB:GND) U7.H8(ABB:GND) U7.J5(ABB:AVSS44_PMU) U7.J6(ABB:AVSS28_ABB) U7.J7(ABB:GND) U7.J8(ABB:GND) U7.K1(ABB:AVSS44_PMU) U7.K6(ABB:GND) U7.L1(ABB:AVSS44_BOOST) U7.L2(ABB:AVSS44_BOOST) U7.M3(ABB:AVSS_SPK) U7.M11(ABB:GND) U7.N8(ABB:RTC_XOSC32_ENB) U7.N9(ABB:AVSS44_DLDO) U7.P2(ABB:AVSS_SPK) U9.2(GND) U9.3(GND) U9.5(GND) U10.1 U10.2 U10.3 U10.4 U10.5 U10.6 U10.7 U10.8 U10.9 U10.10 U11.15(GND) U11.26(GND) U11.27(GND) U11.35(GND) U12.4(GND) U13.1(GND) U13.2(GND) U14.1(GND) U14.2(GND) U14.5(GND) U14.6(GND) U14.8(GND) U14.9(GND) U14.10(GND) U14.11(GND) U14.12(GND) U14.13(GND) U14.18(GND) U14.20(GND) U14.21(GND) U14.22(GND) U14.23(GND) U14.24(GND) U14.25(GND) U14.28(GND) U14.32(GND) U14.33(GND) U14.34(GND) U14.35(GND) U14.36(GND) U15.4(GND) U15.6(GND) U15.8(GND) U16.5(GND) U16.PAD(GND) U18.11(GND) U19.1(GND) U20.4(GND) U20.7(FSEL) WI-FI/BT.GND1 WI-FI/BT.GND2 WI-FI/BT.GND3 X2.1 X2.2 X3.2 X3.4
GNSS_CORE_1V1: C37.1 C41.1 C42.1 U2.6(DVDD11_CORE1) U2.13(AVDD11_CLDO) U2.24(DVDD11_CORE2) U2.43(DVDD11_CORE3)
GNSS_DCV: L3.1 U2.15(DCV)
GNSS_DCV_1V8: C34.1 C44.1 L3.2 R80.1 U2.1(AVDD18_RXFE) U2.4(AVDD18_CM) U2.12(AVDD28_CLDO) U2.17(DCV_FB)
GNSS_EN: U4.3(CE) U7.D8(BB:KCOL0)
GNSS_FRAME_SYNC: R26.1 R65.1 U7.B12(BB:KCOL1)
GNSS_HRST: R52.1 U7.H12(ABB:SIM2_SCLK)
GNSS_REF: C38.1 U2.7(VREF)
GNSS_TXIND: U2.25(TX1/TXIND/RTS0/MM_I2CD/CXO_CS/GIO1) U7.E6(BB:KCOL2)
GNSS_UART_RX: U2.35(RX0/MM_I2CC/H_SPI_SI) U7.E13(BB:KROW4)
GNSS_UART_TX: R63.1 U2.37(TX0/MM_I2CD/H_SPI_SO) U7.D10(BB:KCOL4)
GNSS_VGNSS_MAIN: C31.2 C35.1 C39.1 C46.1 U2.9(AVDD43_VBAT) U2.16(AVDD43_DCV) U4.5(VOUT)
GNSS_VRTC_1V1: C31.1 C99.1 U2.18(AVDD11_RTC)
GNSS_VRTC_4V3: C29.1 D1.- R7.1 U2.19(AVDD43_RTC)
GNSS_VTCXO_SW: C26.1 C80.1 C119.1 C120.1 L20.2 R41.2 U2.10(AVDD_TCXO_SW) U13.4(VCC) X2.4
GNSS_VTLDO: C36.1 C40.1 R31.1 U2.11(AVDD28_TLDO) U2.30(DVDD28_IO1) U2.42(DVDD28_IO2)
GPIO0/ADC0/U3RX: C103.1 R59.1 R88.1 U7.F8(BB:GPIO_0) U17.4
GPIO1/ADC1/U3TX: C102.1 R58.1 R89.1 U7.E12(BB:GPIO_1) U17.5
GPIO2/ADC2/PWM0: C89.1 R45.1 R90.1 U7.D11(BB:GPIO_2) U17.2
GPIO13/EINT11/PWM0: R64.1 U7.D12(BB:KCOL3) U18.4(A3)
GPIO19/PWM1: R66.1 U7.C11(BB:KROW2) U18.5(A4)
GPIO40/SIM2_SIO: Q10.2(S) R112.2 U7.J12(ABB:SIM2_SIO)
GPIO_3/PWM1: U7.D13(BB:GPIO_3) U18.1(A1)
GPS_RFIN: C67.2 L18.1 U2.48(RF_IN)
GPS_RTC_32K: U2.21(XIN) U7.J11(ABB:SIM2_SRST)
ISENSE: Q14.3(C) R94.2 U7.H2(ABB:ISENSE) U8.1(C) U8.2(C) U8.5(C) U8.6(C)
JTAG_2V8: JTAG.1 R38.2
JTCK: JTAG.9 R65.2
JTDI: JTAG.7 R63.2
JTDO: JTAG.8 R66.2
JTMS: JTAG.10 R64.2
JTRST_B: JTAG.6 R39.2
JTRTCK: JTAG.4 R68.1
LPTE_MUX: Q13.2(S) R118.2 U7.J10(BB:LPTE)
LSA0_LCM: R24.2 R37.2 U7.J9(BB:LSA0)
LSCE_B/EINT20: Q11.2(S) R114.2 U7.G9(BB:LSCE_B)
LSCK_LCM: R97.1 U7.L10(BB:LSCK)
LSDA_LCM/EINT21: Q12.2(S) R115.2 U7.L11(BB:LSDA)
LSRSTB: R96.1 U7.H9(BB:LSRSTB)
M_SCL: Q4.3(D) R23.2 R73.1 U11.18(SCL) U11.24(PC5/AD5/D19/SCL)
M_SDA: Q3.3(D) R22.2 R71.1 U11.17(SDA) U11.23(PC4/AD4/D18/SDA)
MC2_CLK: J4.5(SD_CLK) U6.1(NC1)
MC2_CMD: J4.3(CMD) U6.5(NC2)
MC2_DA0: J4.7(DAT0) U6.9(NC3)
MCINS: J4.SA(SWITCH-A) U7.D7(BB:KROW0)
MIC1_N: C55.1 U7.N5(ABB:AU_VIN1_N)
MIC1_P: C58.1 U7.P5(ABB:AU_VIN1_P)
MICBIAS0: R12.2 U7.L4(ABB:AU_MICBIAS0)
MP3_OUTL: L9.1 U7.P1(ABB:AU_HPL)
MP3_OUTR: L10.1 U7.N1(ABB:AU_HPR)
N$1: R87.1 U1.F8(ANTSEL_3)
N$2: C27.1 C85.1 R79.1
N$3: R92.1 U1.G9(ANTSEL_2)
N$4: R69.2 U18.10(OE)
N$5: J4.1(DAT2) R74.2
N$6: C24.1 U9.1(INPUT)
N$7: C6.1 U1.A1(REF)
N$8: C20.2 U1.A7(OSC_IN)
N$9: C15.1 R4.2 U1.A6(AVDD33_XO)
N$10: C85.2 GPS.D L20.1
N$11: J1.1 R28.1
N$12: L6.2 U1.A3(LXBK)
N$13: L5.2 U13.3(RFIN)
N$14: C25.1 U9.4(OUTPUT)
N$15: J11.1 R23.1
N$16: C43.1 U2.5(OSC)
N$17: C148.+ R7.2
N$18: R41.1 U13.5(!SHDN)
N$20: R19.2 SW1.B
N$22: D7.+ L8.2 U20.5(LX)
N$23: J1.2 R27.1
N$24: C51.1 L9.2
N$25: C52.1 L10.2
N$26: C51.2 R10.1
N$27: C52.2 R11.1
N$28: C55.2 C57.1 C59.2 C60.1 R12.1 R13.2
N$29: C96.1 U7.N10(ABB:VIBR)
N$30: Q6.3(D) RX.+
N$31: R47.1 U7.H10(ABB:RESETB)
N$32: D15.- U11.30(RESET)
N$33: C84.1 R21.1 WI-FI/BT.D
N$34: R33.2 U12.6(EN/SYNC)
N$35: R30.2 U20.1(COMP)
N$36: C157.2 R30.1
N$38: R62.2 R91.2 U20.2(FB)
N$39: Q6.2(S) R76.1
N$40: J11.2 R22.1
N$41: J4.2(CD/DAT3) R2.2
N$42: C115.1 C137.1 R21.2
N$43: Q7.2(S) R77.1
N$44: R48.1 U12.5(BS)
N$45: C105.2 R48.2
N$46: R50.1 U12.8(FB)
N$47: C77.1 U12.7(VCC)
N$48: C78.1 R51.2
N$49: C104.1 U7.D1(ABB:VRF)
N$50: C105.1 L13.2 U12.3(SW)
N$51: C100.1 U12.1(SS)
N$52: R34.1 R35.1 R50.2 R51.1
N$55: J16.1 L21.2
N$56: PWR.+ R78.1
N$57: R36.1 RST.+
N$58: R52.2 U2.47(HRST_B)
N$59: C158.1 U20.8(SS)
N$60: J4.8(DAT1) R72.2
N$61: R26.2 U2.33(FRAME_SYNNC/DBG_RX/GIO8)
N$62: C113.1 L4.1 L12.2 L14.1
N$63: C112.1 L4.2
N$64: C43.2 X2.3
N$65: C25.2 L5.1
N$66: C111.2 L15.2
N$67: C118.1 U13.6(RFOUT)
N$68: C67.1 C68.1 C118.2
N$69: R31.2 U2.32(RX2/SPI_SI/JDI/DBG_RX/BSI_CK/GIO2)
N$70: R80.2 U2.40(BSI_CS/MM_I2CD/DUTY_CYCLE/PPS/GIO7)
N$71: J16.6 R40.2 R53.1
N$72: C124.1 GSM.D R54.1
N$73: C83.1 C125.1 R1.2 R54.2
N$74: C130.1 R55.1 U14.31(TX_EN)
N$75: C131.1 R56.1 R57.1 U14.30(VRAMP)
N$76: C132.1 L17.1 U14.16(RX_LB)
N$77: C133.1 L19.1 U14.15(RX_HB)
N$78: Q1.3(D) Q14.1(B) U8.3(B)
N$80: L1.1 U14.4(RFIN_LB)
N$81: L16.1 U14.3(RFIN_HB)
N$82: C136.1 U14.7(VBAT2)
N$83: C129.1 R60.1 U14.29(SW1)
N$84: C93.1 C107.+ R8.2
N$85: C138.2 U15.1(UNBALANCED_PORT)
N$86: Q7.3(D) TX.+
N$88: C138.1 U16.6(OUTPUT1)
N$89: C145.1 U16.4(OUTPUT2)
N$90: C137.2 U16.2(INPUT)
N$91: L.+ R49.1
N$94: L.- Q2.3(D)
N$95: R20.2 SW1.A
N$104: R105.2 SW2.A SW2.COM
N$105: C24.2 C117.1 R79.2
N$106: J16.4 L22.2
N$107: J16.3 J16.7 L23.2
N$108: Q6.1(G) R106.1
N$109: Q7.1(G) R107.1
N$110: Q2.1(G) R29.2 R108.2
N$111: R109.2 U2.31(SCK1/SPI_SCK/GIO4)
N$112: R110.2 U2.41(SCS1#/SPI_SCS#/BSI_DATA/SYNC_PULSE/GIO5)
PALDO_3V3: C18.2 C139.1 C140.1 C152.2 R4.1 U1.A5(PALDO) U1.A9(AVDD33_TX) U1.E5(PALDO_FB) U15.2(NC/DC_FEED) ; supply symbol labelled POWER_CIRCLE
PB1/D9/PWM1: U11.10(PB1/D9/PWM) U18.16(B4)
PD0/RX: Q9.3(D) R28.2 R111.1 U11.1(PD0/D0/RX)
PD1/TX: Q8.3(D) R27.2 R83.1 U11.2(PD1/D1/TX)
PD2/INT0: Q11.3(D) R116.1 U11.3(PD2/D2/INT0)
PD3/INT1/PWM0: U11.4(PD3/D3/INT1/PWM) U18.17(B3)
PD4: Q10.3(D) R113.1 U11.5(PD4/D4)
PD5/PWM: U11.6(PD5/D5/PWM) U18.20(B1)
PD6/PWM: U11.7(PD6/D6/PWM) U18.18(B2)
PD7: Q13.3(D) R119.1 U11.8(PD7/D7)
PWRKEY: R105.1 U7.G4(ABB:PWRKEY)
RESET: C81.1 D15.+ JTAG.5 R47.2 R81.1 RESET.1 RST.-
RXHB_P: L19.2 U7.B1(RF:RXHB)
RXLB_P: L17.2 U7.A1(RF:RXLB)
SIM1_SCLK: C62.1 J4.C3(SIM_CLK) U7.K7(ABB:SIM1_SCLK)
SIM1_SIO: C64.1 J4.C7(I/O) U7.L9(ABB:SIM1_SIO)
SIM1_SRST: C61.1 J4.C2(RST) U7.K8(ABB:SIM1_SRST)
SMPSLDO_1V6: C11.1 C13.2 C16.2 C17.2 C19.2 L6.1 U1.A8(AVDD16_SX) U1.C2(AVDD16_CLDO) U1.C3(OUT_FB) U1.D10(AVDD16_TRX) U1.E10(AVDD16_LF)
SPI_MISO: U11.13(PB4/D12/MISO) U11.38(MISO) U18.13(B7)
SPI_MOSI: U11.12(PB3/D11/MOSI/PWM) U11.34(MOSI) U18.14(B6)
SPI_SCL: U11.14(PB5/D13/SCK) U11.37(SCK) U18.12(B8)
SPI_SS: U11.11(PB2/D10/SS/PWM) U18.15(B5)
SQI_CE: U3.1(CS#) U7.G13(BB:SFSCS0)
SQI_SCK: U3.6(SCLK) U7.G8(BB:SFSCK)
SQI_SI: U3.5(SI/SIO0) U7.F9(BB:SFSOUT)
SQI_SIO2: U3.3(WP#/SIO2) U7.F12(BB:SFSWP)
SQI_SIO3: U3.7(RESET#SIO3) U7.F10(BB:SFSHOLD)
SQI_SO: U3.2(SO/SIO1) U7.G12(BB:SFSIN)
SW_SPI/SDIO: SW1.COM U6.2(INA) U6.10(INB)
TR_N: C141.1 L7.1 U15.7(BALANCED_PORT)
TR_P: C141.2 R61.1 U15.5(BALANCED_PORT)
TRX_IO_N: C142.1 L7.2 U1.C10(TRX_IO_N)
TRX_IO_P: C142.2 R61.2 U1.B10(TRX_IO_P)
TX_EN: R55.2 R75.2 U7.A9(RF:BPI_BUS1)
TXO_HB: C134.1 L16.2 U7.C2(RF:TX_HB)
TXO_LB: C135.1 L1.2 U7.B2(RF:TX_LB)
UART1_RX: Q9.2(S) R82.2 R106.2 U7.E9(BB:URXD1)
UART1_TX: Q8.2(S) R46.2 R107.2 U7.E8(BB:UTXD1)
USB_5V: C49.+ C74.1 C98.1 C106.1 C116.1 J7.1(VCC) Q14.2(E) R33.1 R70.1 R93.1 U8.4(E) U12.2(IN) VCHG_5V1.T
USB_N: DP.T J7.2(DM) R17.1
USB_P: DN.T J7.3(DP) R18.1
USBD_N: D6.1 R17.2 U7.N11(BB:USB11_DM)
USBD_P: D6.2 R18.2 U7.P11(BB:USB11_DP)
VA: C94.1 U7.P3(ABB:VA)
VBAT: C3.1 C8.1 C30.+ C33.+ C45.1 C50.+ C72.1 C73.1 C101.1 C126.2 C127.2 C128.2 D2.2(-) L2.1 L8.1 R78.2 SW3.COM1 SW3.COM2 U4.1(VIN) U7.E1(ABB:VBAT_VA) U7.H1(ABB:BATSNS) U7.L3(ABB:AVDD_SPK) U7.M10(ABB:VBAT_DIGITAL) U14.26(VBAT1) U20.3(EN) U20.6(VDD) VBAT_TP.T
VCDT: R70.2 R86.1 U7.J4(ABB:VCDT)
VCORE: C69.1 U7.A11(ABB:VDDK) U7.P9(ABB:VCORE)
VIO18_LDO: C70.1 Q11.1(G) Q12.1(G) Q13.1(G) R37.1 R114.1 R115.1 R118.1 U7.N13(ABB:VIO18) U7.P13(ABB:VIO18)
VIO28_LDO: C5.1 C14.2 C23.1 C63.1 C71.1 C122.1 Q3.1(G) Q4.1(G) Q8.1(G) Q9.1(G) Q10.1(G) R36.2 R38.1 R46.1 R49.2 R53.2 R67.1 R69.1 R76.2 R77.2 R81.2 R82.1 R87.2 R92.2 R98.1 R99.1 R112.1 U1.D3(AVDDRTC) U1.H1(DVDDIO3) U1.J7(DVDDIO2) U1.K7(DVDDIO1) U1.K10(DVDDIO0) U7.B7(RF:AVDD15_BTRF) U7.B8(ABB:VIO28) U17.3 U17.6 U18.2(VCCA) VIO_28.T
VIO33_LDO: C2.1 C7.1 C32.1 C87.1 R20.1 R71.2 R73.2 R83.2 R111.2 R113.2 R116.2 R117.2 R119.2 U6.14(VCC) U11.29(3V3) U11.31(ADC7) U18.19(VCCB) U19.2(OUT) U19.4(OUT)
VMC: C66.1 C95.1 J4.4(VDD) R2.1 R72.1 R74.1 U7.K9(ABB:VMC)
VREF: C92.1 U7.G1(ABB:VREF)
VRTC: D1.+ R8.1 U7.P8(ABB:VRTC)
VSF: C47.1 C91.1 U3.8(VCC) U7.F11(ABB:VSF)
VSIM1: C65.1 C97.1 J4.C1(VCC) J4.C6(VPP) U7.L7(ABB:VSIM1)
VSIM2: C9.1 U7.H13(ABB:VSIM2)
VUSB: C10.1 U7.P12(ABB:VUSB)
WIFI_BT_PRI: R5.1 R68.2 U1.H7(BT_PRI) U7.C12(BB:KROW1)
WIFI_EN: R3.1 U1.B5(PAD_EN) U7.C3(BB:GPIO_10)
WIFI_MC1CLK: U1.J2(OE_N) U7.K12(BB:MCCK)
WIFI_MC1CMD: U1.J1(A0) U7.L13(BB:MCCM0)
WIFI_MC1DA0: U1.H3(D0) U7.K13(BB:MCDA0)
WIFI_MC1DA1: U1.J3(D1) U7.M12(BB:MCDA1)
WIFI_MC1DA2: U1.H2(D2) U7.L12(BB:MCDA2)
WIFI_MC1DA3: U1.K2(D3) U7.N12(BB:MCDA3)
WIFI_OSC_EN: U1.F9(OSC_EN) U7.B3(BB:SRCLKENAI)
WIFI_RST_N: U1.K9(SYSRST_B) U7.C4(BB:GPIO_11)
WIFI_RTC: R32.2 R39.1 U7.E7(BB:KROW3)
WIFI_XIN: R32.1 U1.D1(X32K_IN)
XIN: C75.1 U7.M7(ABB:XIN) X1.1
XMIC: C56.1 C58.2 C59.1 D3.2 L21.1 R13.1 R14.1
XMP3_L: C54.1 D3.1 L22.1 R10.2 R16.1
XMP3_R: C53.1 D4.1 L23.1 R11.2 R15.1
XOUT: C76.1 U7.M6(ABB:XOUT) X1.2
Unconnected: J7.4(ID) J16.5 J16.8 U1.D2(X32K_OUT) U1.E3(D7) U1.E6(TRX_IP) U1.E7(TRX_IN) U1.E8(TRX_QP) U1.E9(TRX_QN) U1.F2(WE_N) U1.F3(CS_N) U1.F10(PAD_ICAL_EXTR) U1.G1(D4) U1.G2(D5) U1.G3(D6) U1.G10(GPIO_0) U1.H4(D10) U1.H5(D11) U1.H6(D12) U1.H8(EXT_INT_B) U1.H9(GPIO_1) U1.H10(UART_DBG_RX) U1.J4(D9) U1.J5(D14) U1.J6(D15) U1.J10(UART_DBG_TX) U1.K4(D8) U1.K6(D13) U2.2(T1P) U2.3(T1N) U2.20(XOUT) U2.22(FORCE_ON) U2.23(32K_OUT/DR_IN) U2.26(BSI_CK/MM_I2CC/ECLK/GIO6) U2.27(RX1/H_SPI_SCK/CTS0/MM_I2CC/CXO_TSENS/GIO0) U2.28(TX2/SPI_SO/DBG_TX/GIO3) U2.34(CXO_CS/GIO10) U2.36(EINT2/DBG_RX/PPS/GPIO14) U2.38(H_SPI_SCS#/CXO_TSENS/SYNC_PULSE/GIO11) U2.39(PPS/DBG_TX/GIO9) U2.44(EINT0/MM_I2CC/SBI_CS/GIO12) U2.45(EINT1/MM_I2CD/PPS/BSI_DATA/GIO13) U4.4(NC) U6.11(NO4) U6.12(COM4) U6.13(NC4) U7.F3(ABB:VCAMA) U7.J3(ABB:KPLED) U7.K2(ABB:ISINK) U7.L6(BB:AUXIN4) U7.M2(ABB:SPK_OUTN) U7.N2(ABB:SPK_OUTP) U7.N3(ABB:AU_HSP) U7.N4(ABB:AU_HSN) U7.N6(ABB:AU_VIN0_N) U7.P6(ABB:AU_VIN0_P) U11.16(AREF) U11.25(VIN) U11.32(ADC6) U11.33(VCC) U11.36(RST) U14.14(NC) U14.17(NC) U14.27(NC) U15.3(NC) U17.1

## Notes on the sheet
- SYS CONFIG
- direct to GND plane of charge pump
- RESET KEY
- FOR ESD
- YiLong.Qin | Bruce Qin
- v0.9
- SD Card/ SPI
- JTAG
- KCOL3
- KCOL1
- IO INTERFACE
  CONFIG
- KROW2
- KROW1 | KCOL4
- KROW3
- HW bootup
- BAT DET | disabled test mode
- Serial Flash
- WIFI
- 0:VSF 1V8
- 1:VSF 3V0 | 500mA
- JTAG MODE
- USB UART
- USB MASS Storage
- JTAG MODE   R67     NC/R85
  NORMAL      NC/R67  R85
- YiLong.Qin | Bruce Qin
- v0.9
- POWER
- Reserved
- BATTERY
- LOW   T-card  (defualt)
  High   SPI
- U10 & Q2 compatibility | differential line
- DCDC 5V TO 4.2V
- SD | SPI
- BAT
- DCDC
- YiLong.Qin | Bruce Qin
- v0.9
- EXTEND INTERFACE
- GPIO Interface
- 2.8V | 1.8V
- D4 | D7
- SPI Interface
- UART_RX | D8
- UART_TX | D2
- IIC_SCL
- 500mA
- IIC_SDA
- YiLong.Qin | Bruce Qin
- v0.9
- must close to 2502
  the max trace is 80mil
- GSM/GPRS
- C63 close to MT2502 B7
- must close to PA
  the max trace is 50mil
- YiLong.Qin | Bruce Qin
- v0.9
- GPS
- Option: 3V3 supply for active ANT
- 200mA
- close to GPS AVDD43_DCV [PIN16] | close to GPS AVDD11_CLDO [PIN13]
- 16.368MHZ TCXO : R109 = NC , R110 = NC
- 26MHZ TCXO : R109 = 10K , R110 = NC
- 26MHZ XTAL : R109 = 10K , R110 = 10K
- YiLong.Qin | Bruce Qin | YiLong.Qin | Bruce Qin
- v0.9 | v0.9
- WIFI/BT
- close to MT2502
- optional for better BT
- close to AVDD16_SX [A8] | close to AVDD33_TX [A9] | close to AVDD16_TRX [D10] | close to AVDD16_LF [E10] | close to AVDDRTC [D3] | close to AVDD16_CLDO [C2]
- YiLong.Qin | Bruce Qin | YiLong.Qin | Bruce Qin
- v0.9 | v0.9
- SERIAL FLASH & SD CARD
- Serial Flash
- SD Interface
- SIM
- TF card OUT --SWITCH OPEN
  TF card IN  --SWITCH CONTACT
- YiLong.Qin | Bruce Qin
- v0.9
- AUDIO INTERFACE
- AUDIO
- YiLong.Qin | Bruce Qin
- v0.9
- USB&SIM INTERFACE
- USB | UART Interface
- IIC Interface
- YiLong.Qin | Bruce Qin
- v0.9

## Library data of the parts
C1-C29 C31 C32 C34-C48 C51-C85 C87 C89-C106 C108-C120 C122 C124-C145 C151-C155 C157 C158 = Discrete:C*: Ceramic Capacitors
C30 C33 C49 C50 C88 C156 = Discrete:CAP*: Electrolytic Capacitors,Tantalum Capacitors and Super Capacitors
C107 C148 = template:C-ELECTRIC-DOUBLE-LAYER-CAPACITOR: Electric Double Layer Capacitor DMS3R3204R,DMS3R3224R
D1 D7 D15 = Discrete:D*
D2 = Discrete:D-VOL
D3 D4 D6 = Discrete:D-ESD-3P
DN DP VBAT_TP VCHG_5V1 VIO_28 = Discrete:PAD-TEST-POINT; PARTNO: DNP
GPS GSM WI-FI/BT = Connector :ANTENNA-U-FL
J1 J11 = Connector :TWIG-4P-2.0-SMD-FEMALE-REINFORCE
J2 = Connector :JACK-JST-2P-SMD-PW
J4 = template:HOLDER-SD/SIM-CONNECTER: T-FLASH+SIM
J7 = Connector :USB-MINIUSB-5P
J16 = Connector :AUDIO-8P-SMD
JTAG = template:HEADER-2X5P-2.0
L PWR RST RX TX = Discrete:LED*
L1-L24 = Discrete:L*
P1-P12 = Discrete:PAD-MARK; PARTNO: DNP
Q1-Q4 Q8-Q13 = Discrete:MOSFET-N: IRLL014: http://www.vishay.com/docs/91319/sihll014.pdf
Q6 Q7 = Discrete:MOSFET-P
Q14 = Discrete:TRANSISTOR-PNP*: PNP audion
R1-R8 R10-R41 R45-R94 R96-R99 R104-R119 = Discrete:R*
RESET = Discrete:BUTTON-4P-REINFORCE: TS-1188E http://www.best-dz.com/?thread-374-2.html
SW1 SW2 = Discrete:SWITCH-3P-SMD
SW3 = Discrete:SWITCH-2CH-6P
U1 = template:MT5931: MT5931 is a Wi-Fi device which includes 802.11 b/g/n \ PA \ LNA \ TR-Swithch
U2 = template:MT3332: MT3332 is a high-performance single-chip multi-GNSS solution which includes on-chip CMOS RF and digital baseband.
U3 = template:MX25U12835F: 1.8V 128M-BIT[X1/X2/X4]CMOS MXSMIO(SERIAL MULTI I/O) FLASH MEMORY
U4 = IC:XC6228: 300mA High Speed LDO Regulator with ON/OFF Switch
U6 = template:BCT4699: 0.5 OU .3.3V Quad-SPDT Analog Switch
U7 = template:MT2502A: SOC processor Technical Brief
U8 = template :STT818B: High Gain Low Voltage PNP Power Transistor
U9 = template :FILTER-FOR_GPS1500
U10 = template:SHIELDING-COVER
U11 = moudle:ARDUINO-38P
U12 = template :MP1496DJ: High-Efficiency,2A，16V,500kHz Synchronous,Step-Down Converter http://html.alldatasheetcn.com/html-pdf/551584/MPS/MP1496DJ/55/1/MP1496DJ.html
U13 = template :MAX2659: GPS/GNSS Low-Noise Amplifier
U14 = template :RF1798: Quad-Band GSM850/GSM900/DCS1800/PCS1900 TX Module
U15 = template :FILTER-FB2012: FB2012 Series Multilayer Chip Band Pass Filter+Balun
U16 = template :UPG2176T5N: 50 OU TEMRMINATON TYPE HIGH POWER SPDT SWITCH FOR WIMAX
U17 = template:BAV70S: High-speed double diode array
U18 = template:TXS0108E: 8-BIT BIDIRECTIONAL VOLTAGE-LEVEL TRANSLATOR FOR OPEN-DRAIN AND PUSH-PULL APPLICATIONS
U19 = IC:LD1117: Low Drop Fixed And Adjustable Positive Voltage Regulators http://www.datasheetcatalog.org/datasheet/SGSThomsonMicroelectronics/mXuqtqv.pdf
U20 = IC:ISL97516
X1 = Discrete:CRYSTAL*: CRYSTAL
X2 X3 = template :CRYSTAL

## Net classes
0 default: width 0.076 mm, drill 0.102 mm, clearance 0.076 mm